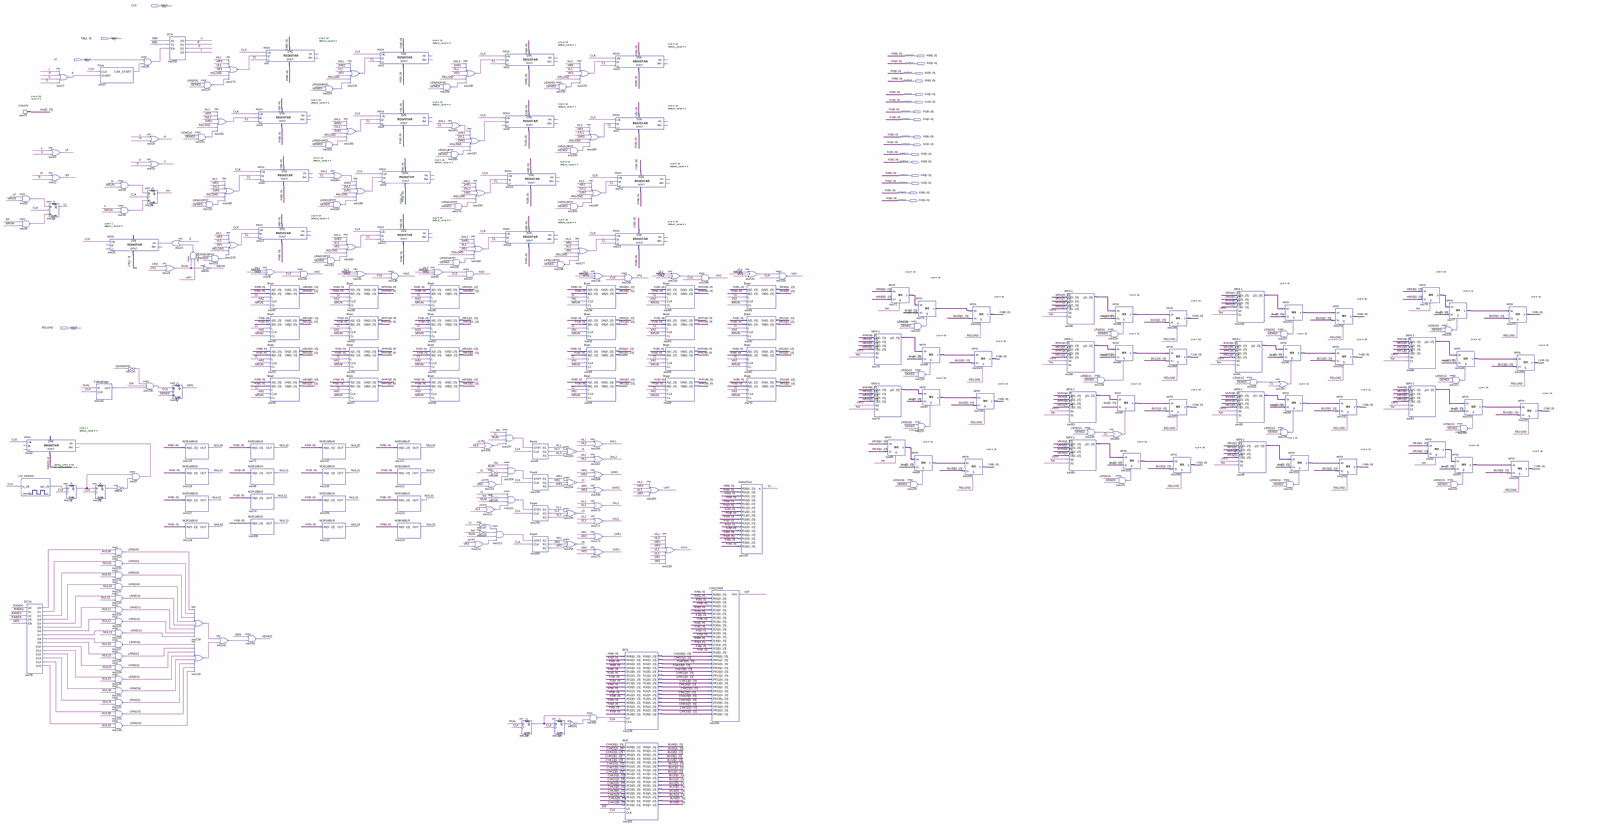
[diagram p0: schematic sheet, whole]
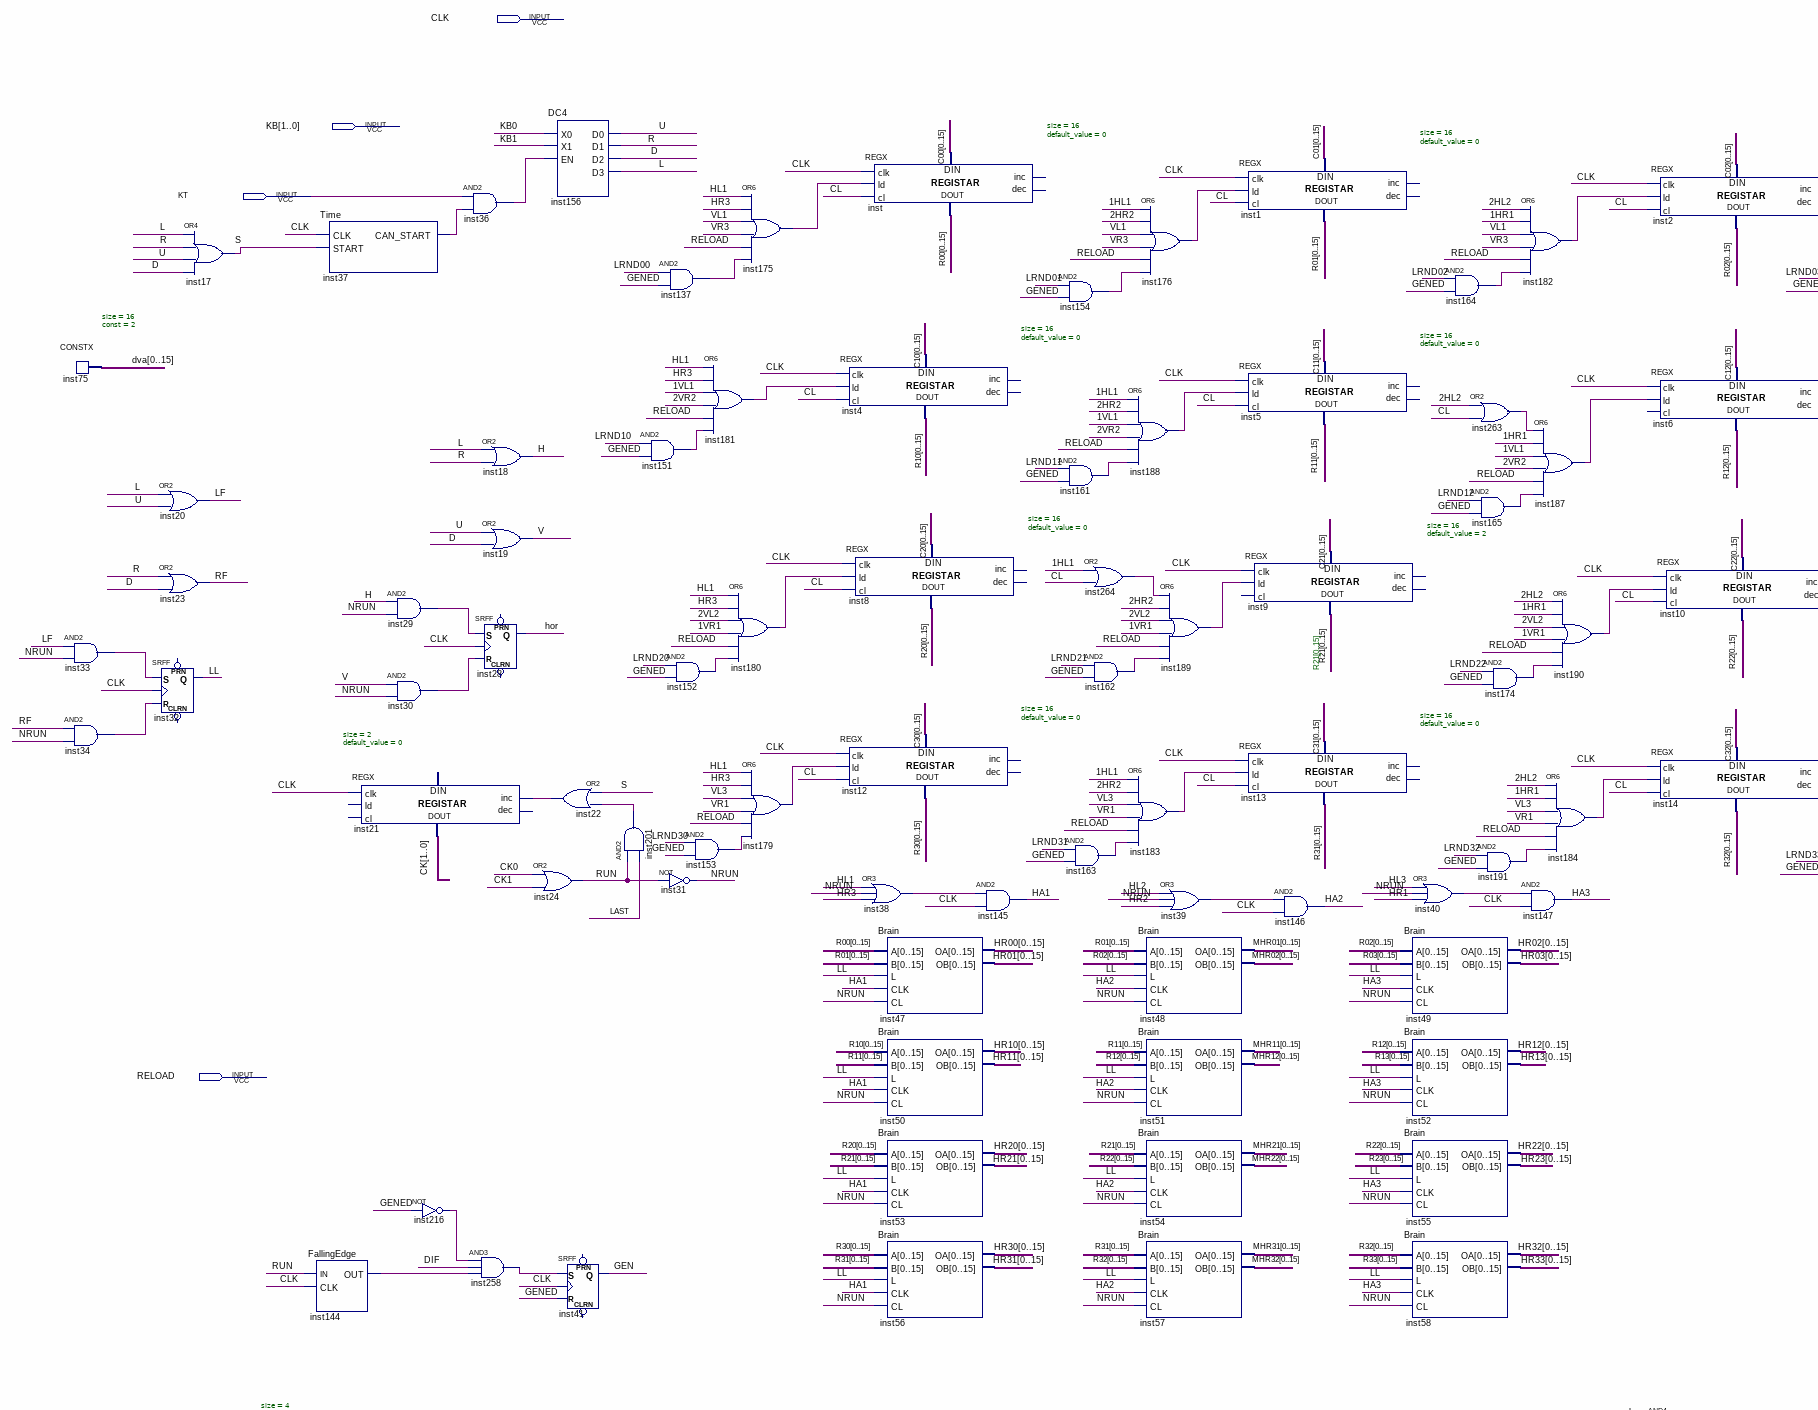
[diagram p1: schematic sheet, upper left part]
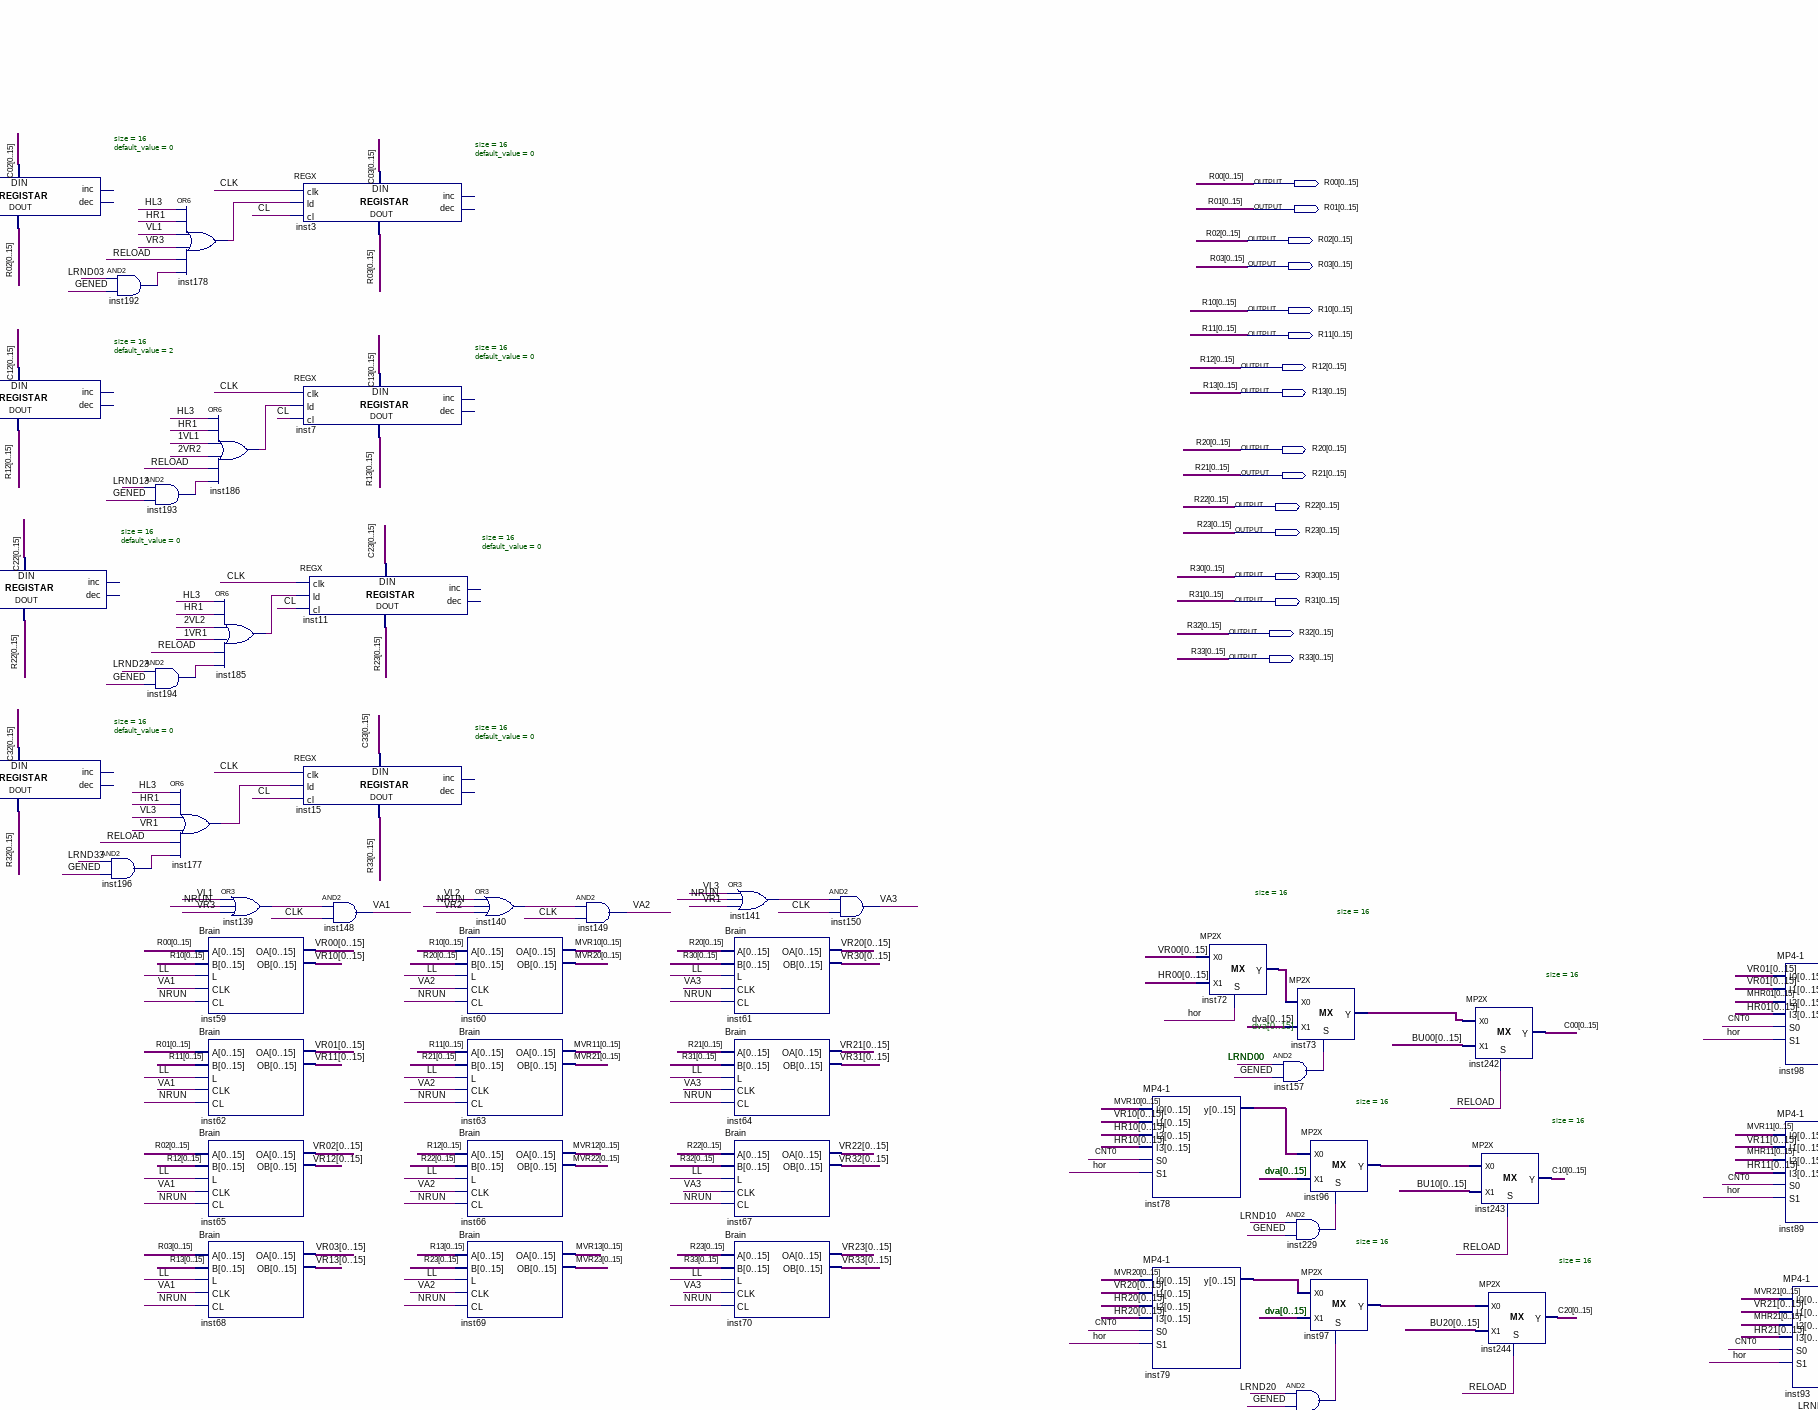
[diagram p2: schematic sheet, upper centre part]
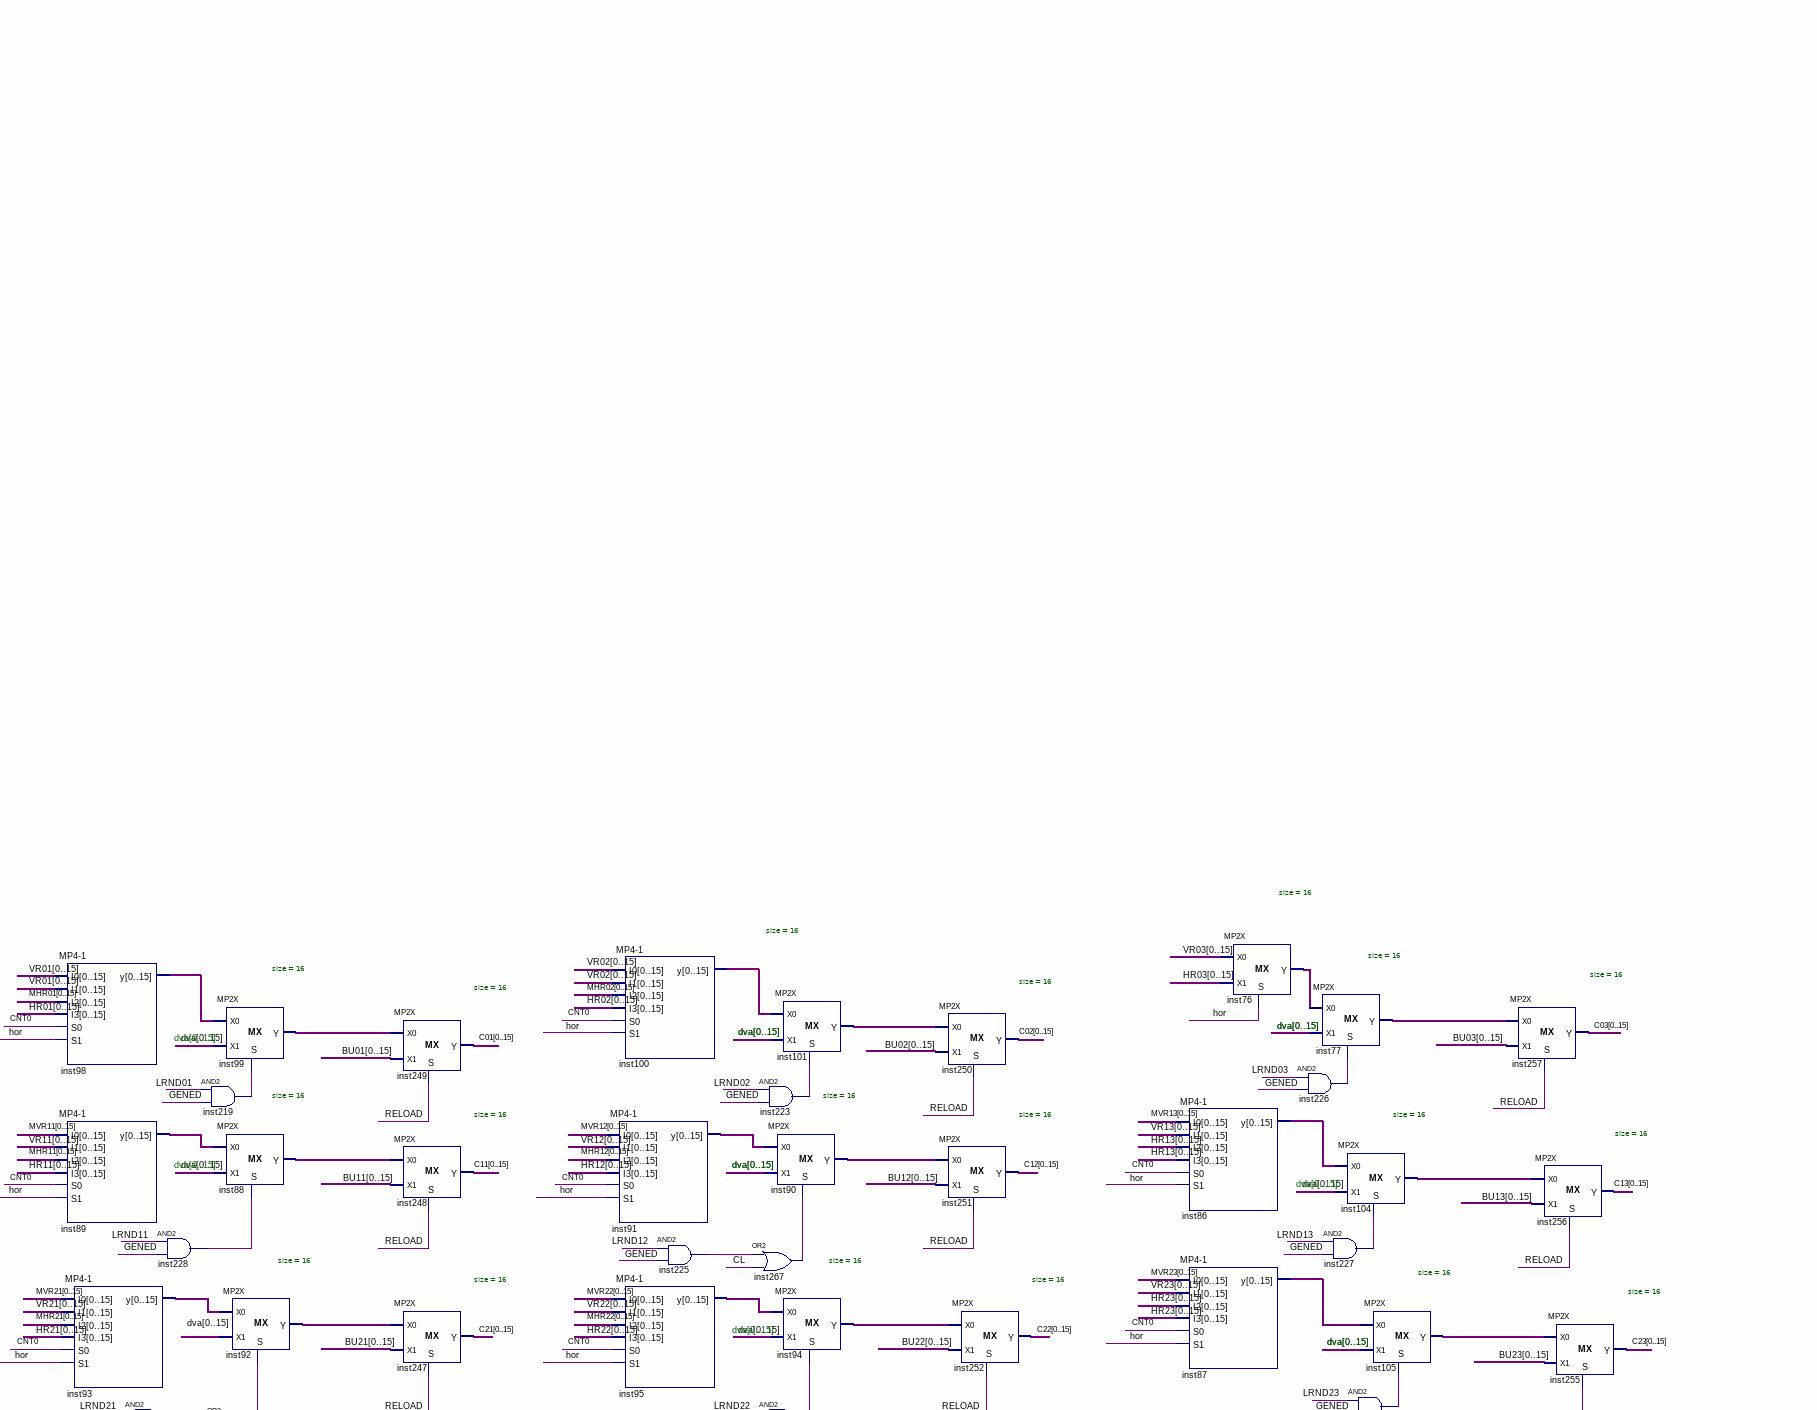
[diagram p3: schematic sheet, upper right part]
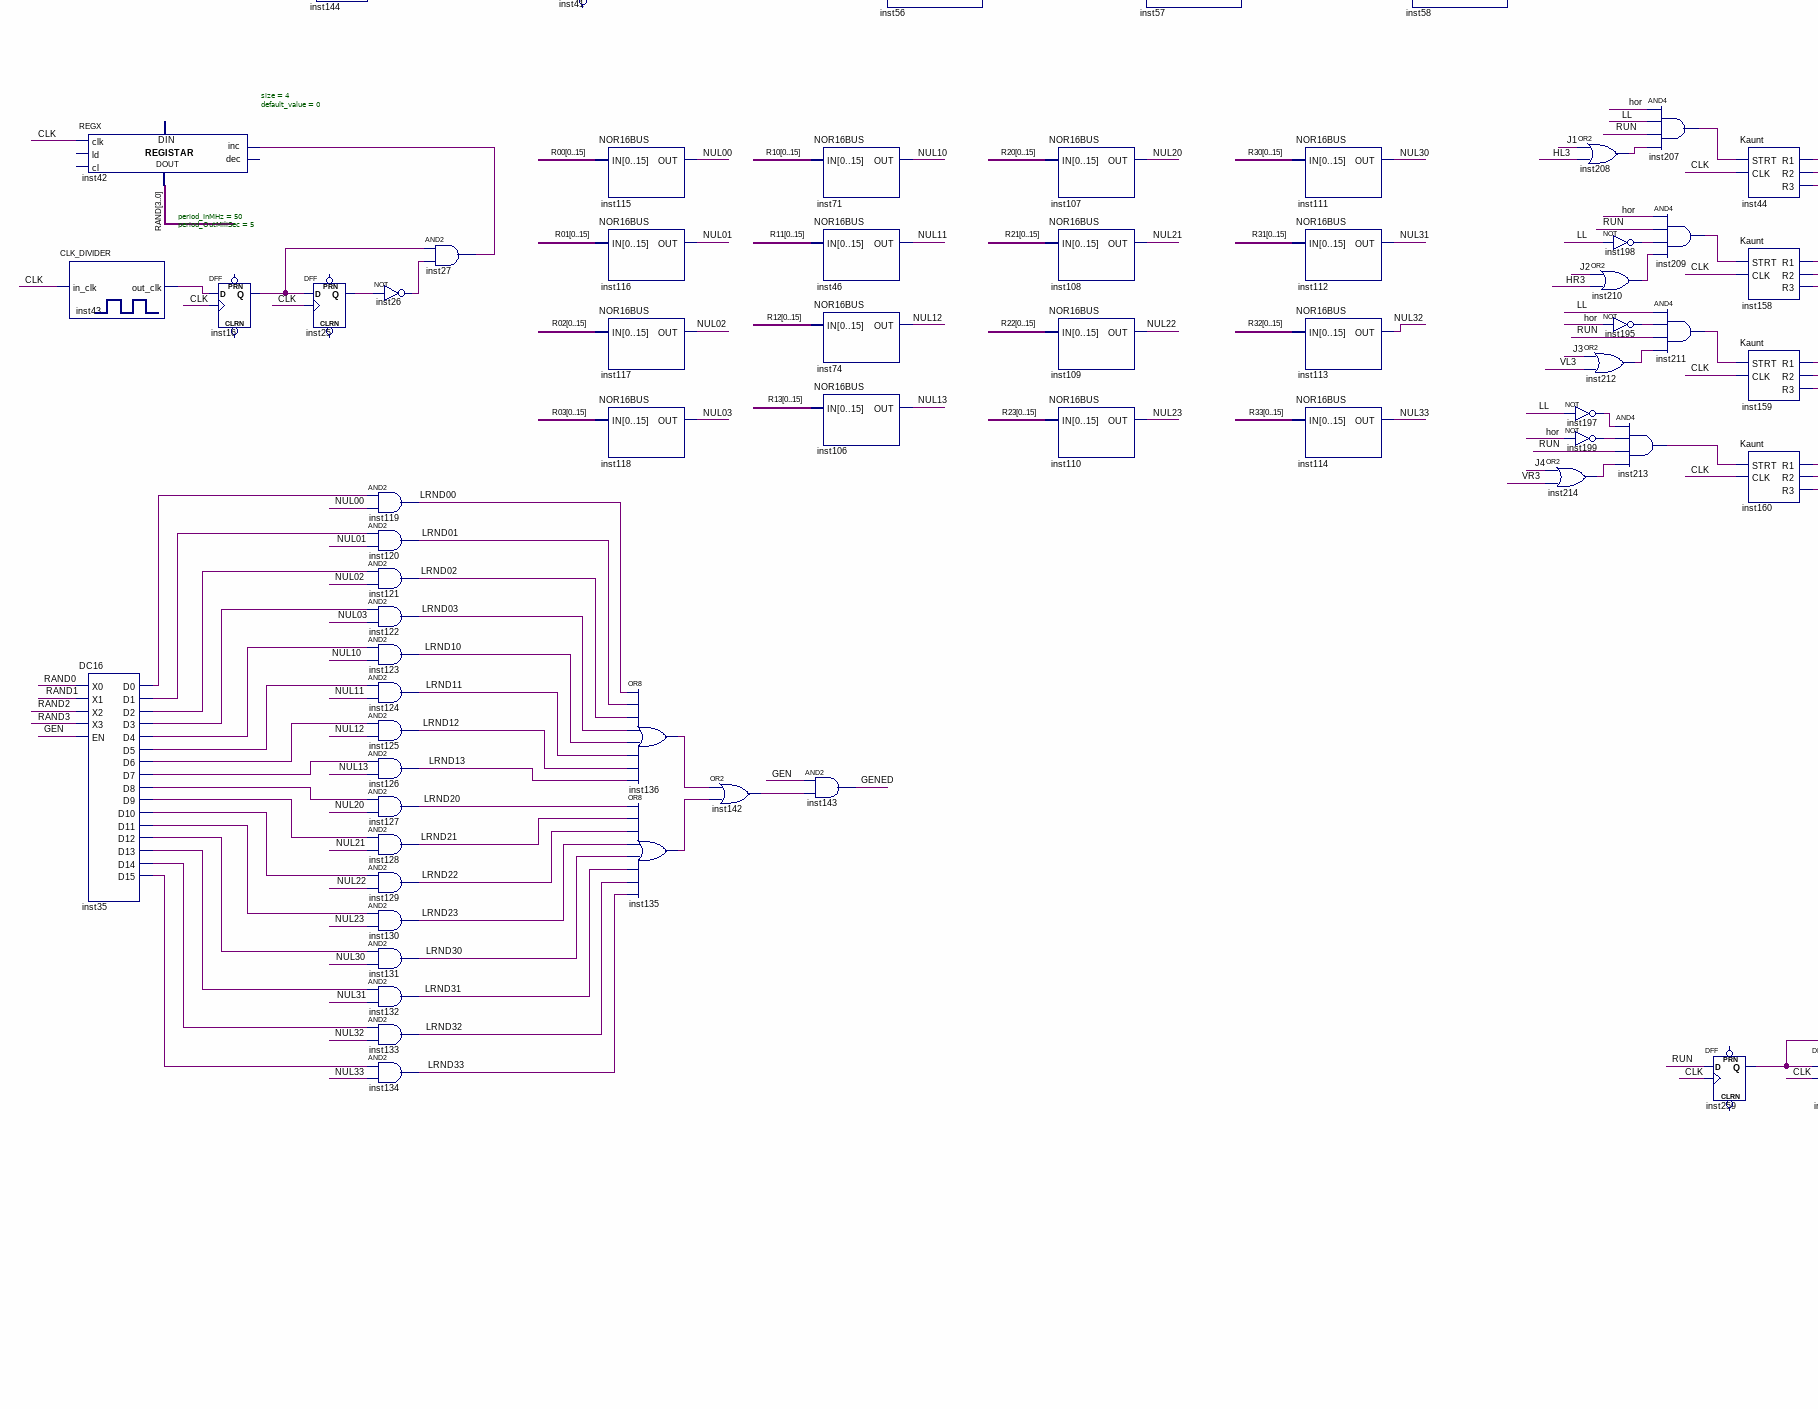
[diagram p4: schematic sheet, lower left part]
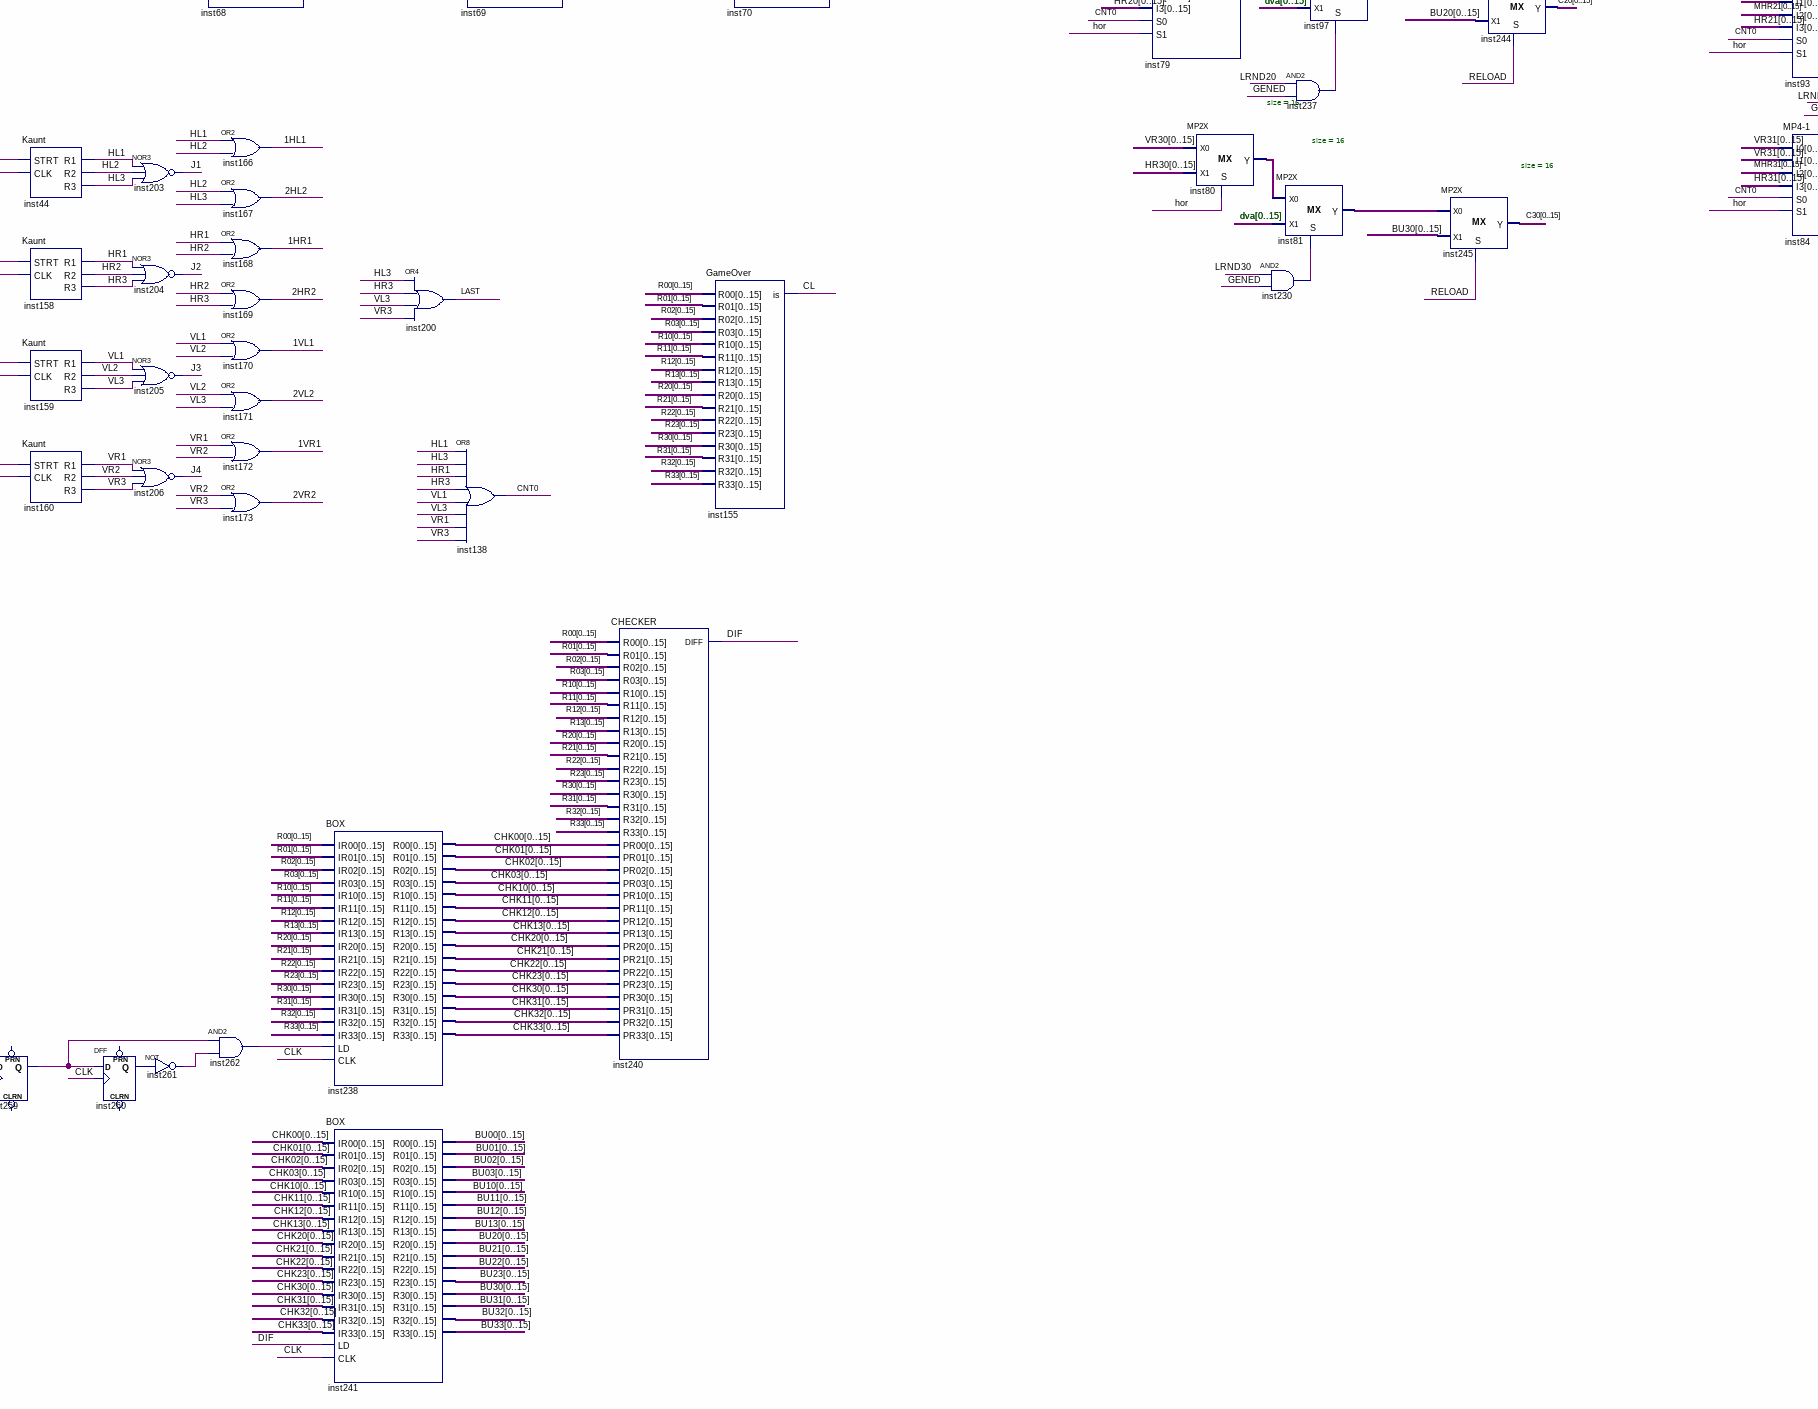
[diagram p5: schematic sheet, lower centre part]
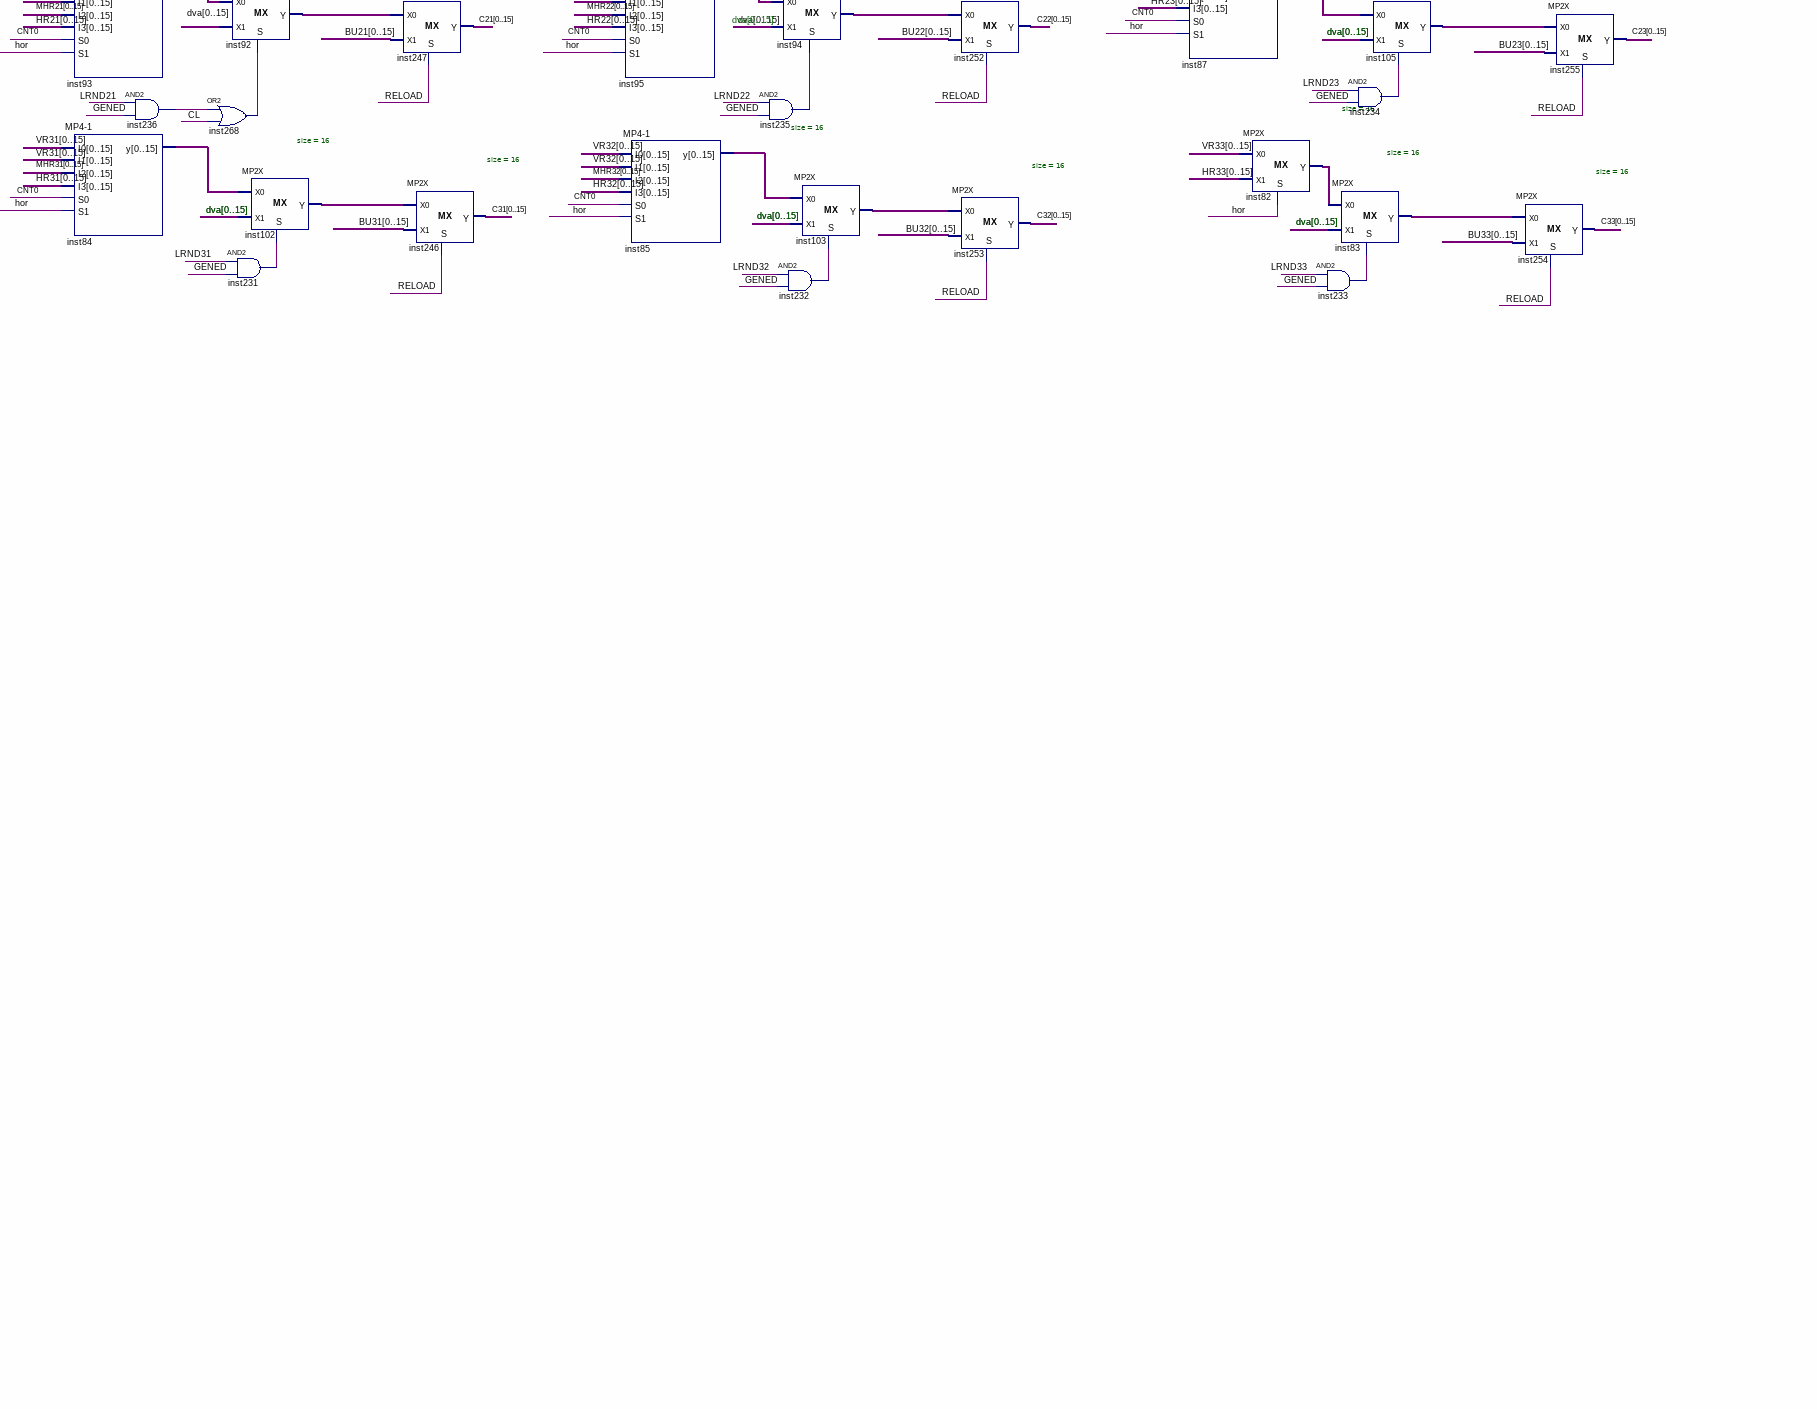
[diagram p6: schematic sheet, lower right part]
// Quartus schematic 2048.bdf as structural Verilog: 257 symbols, 20 pins
module \2048  (
  input  CLK,
  input  [1:0] KB,
  input  KT,
  input  RELOAD,
  output [0:15] R00,
  output [0:15] R01,
  output [0:15] R02,
  output [0:15] R03,
  output [0:15] R10,
  output [0:15] R11,
  output [0:15] R12,
  output [0:15] R13,
  output [0:15] R20,
  output [0:15] R21,
  output [0:15] R22,
  output [0:15] R23,
  output [0:15] R30,
  output [0:15] R31,
  output [0:15] R32,
  output [0:15] R33
);

  wire \1HL1 , \1HR1 , \1VL1 , \1VR1 , \2HL2 , \2HR2 , \2VL2 , \2VR2 , CL, CNT0, D, DIF, GEN, GENED, H, HA1,
       HA2, HA3, HL1, HL2, HL3, hor, HR1, HR2, HR3, inst16_q, inst22_out, inst25_q, inst26_out, inst27_out,
       inst29_out, inst30_out, inst33_out, inst34_out, inst35_d0, inst35_d1, inst35_d2, inst35_d3, inst35_d4,
       inst35_d5, inst35_d6, inst35_d7, inst35_d8, inst35_d9, inst35_d10, inst35_d11, inst35_d12, inst35_d13,
       inst35_d14, inst35_d15, inst36_out, inst37_can_start, inst38_out, inst39_out, inst40_out,
       inst43_out_clk, inst135_out, inst136_out, inst137_out, inst139_out, inst140_out, inst141_out,
       inst142_out, inst144_out, inst151_out, inst152_out, inst153_out, inst154_out, inst157_out,
       inst161_out, inst162_out, inst163_out, inst164_out, inst165_out, inst174_out, inst175_out,
       inst176_out, inst177_out, inst178_out, inst179_out, inst180_out, inst181_out, inst182_out,
       inst183_out, inst184_out, inst185_out, inst186_out, inst187_out, inst188_out, inst189_out,
       inst190_out, inst191_out, inst192_out, inst193_out, inst194_out, inst195_out, inst196_out,
       inst197_out, inst198_out, inst199_out, inst201_out, inst207_out, inst208_out, inst209_out,
       inst210_out, inst211_out, inst212_out, inst213_out, inst214_out, inst216_out, inst219_out,
       inst223_out, inst225_out, inst226_out, inst227_out, inst228_out, inst229_out, inst230_out,
       inst231_out, inst232_out, inst233_out, inst234_out, inst235_out, inst236_out, inst237_out,
       inst258_out, inst259_q, inst260_q, inst261_out, inst262_out, inst263_out, inst264_out, inst267_out,
       inst268_out, J1, J2, J3, J4, L, LAST, LF, LL, LRND00, LRND01, LRND02, LRND03, LRND10, LRND11, LRND12,
       LRND13, LRND20, LRND21, LRND22, LRND23, LRND30, LRND31, LRND32, LRND33, NRUN, NUL00, NUL01, NUL02,
       NUL03, NUL10, NUL11, NUL12, NUL13, NUL20, NUL21, NUL22, NUL23, NUL30, NUL31, NUL32, NUL33, R, RF, RUN,
       S, U, V, VA1, VA2, VA3, VL1, VL2, VL3, VR1, VR2, VR3;
  wire [1:0] CK;
  wire [3:0] RAND;
  wire [15:0] BU00, BU01, BU02, BU03, BU10, BU11, BU12, BU13, BU20, BU21, BU22, BU23, BU30, BU31, BU32, BU33,
       C00, C01, C02, C03, C10, C11, C12, C13, C20, C21, C22, C23, C30, C31, C32, C33, CHK00, CHK01, CHK02,
       CHK03, CHK10, CHK11, CHK12, CHK13, CHK20, CHK21, CHK22, CHK23, CHK30, CHK31, CHK32, CHK33, dva, HR00,
       HR01, HR02, HR03, HR10, HR11, HR12, HR13, HR20, HR21, HR22, HR23, HR30, HR31, HR32, HR33, inst72_y,
       inst73_y, inst76_y, inst77_y, inst78_y, inst79_y, inst80_y, inst81_y, inst82_y, inst83_y, inst84_y,
       inst85_y, inst86_y, inst87_y, inst88_y, inst89_y, inst90_y, inst91_y, inst92_y, inst93_y, inst94_y,
       inst95_y, inst96_y, inst97_y, inst98_y, inst99_y, inst100_y, inst101_y, inst102_y, inst103_y,
       inst104_y, inst105_y, MHR01, MHR02, MHR11, MHR12, MHR21, MHR22, MHR31, MHR32, MVR10, MVR11, MVR12,
       MVR13, MVR20, MVR21, MVR22, MVR23, VR00, VR01, VR02, VR03, VR10, VR11, VR12, VR13, VR20, VR21, VR22,
       VR23, VR30, VR31, VR32, VR33;

  CONSTX #(.size(16), .\const (2)) inst75 (.data({dva[0], dva[1], dva[2], dva[3], dva[4], dva[5], dva[6], dva[7], dva[8], dva[9], dva[10], dva[11], dva[12], dva[13], dva[14], dva[15]}));
  and inst33 (inst33_out, LF, NRUN);
  and inst34 (inst34_out, RF, NRUN);
  REGX #(.size(4), .default_value(0)) inst42 (
    .clk(CLK), .inc(inst27_out), .data_out(RAND));  // open: ld, cl, dec, data_in
  CLK_DIVIDER #(.period_InMHz(50), .period_OutMiliSec(5)) inst43 (.in_clk(CLK), .out_clk(inst43_out_clk));
  DC16 inst35 (
    .X0(RAND[0]), .X1(RAND[1]), .X2(RAND[2]), .X3(RAND[3]), .EN(GEN), .D0(inst35_d0), .D1(inst35_d1),
    .D2(inst35_d2), .D3(inst35_d3), .D4(inst35_d4), .D5(inst35_d5), .D6(inst35_d6), .D7(inst35_d7),
    .D8(inst35_d8), .D9(inst35_d9), .D10(inst35_d10), .D11(inst35_d11), .D12(inst35_d12), .D13(inst35_d13),
    .D14(inst35_d14), .D15(inst35_d15));
  or inst17 (S, L, R, U, D);
  or inst20 (LF, L, U);
  or inst23 (RF, R, D);
  SRFF inst32 (.S(inst33_out), .R(inst34_out), .CLK(CLK), .Q(LL));  // open: PRN, CLRN
  DFF inst16 (.CLK(CLK), .D(inst43_out_clk), .Q(inst16_q));  // open: CLRN, PRN
  Time inst37 (.CLK(CLK), .START(S), .CAN_START(inst37_can_start));
  FallingEdge inst144 (.IN(RUN), .CLK(CLK), .OUT(inst144_out));
  DFF inst25 (.CLK(CLK), .D(inst16_q), .Q(inst25_q));  // open: CLRN, PRN
  and inst29 (inst29_out, H, NRUN);
  and inst30 (inst30_out, V, NRUN);
  REGX #(.size(2), .default_value(0)) inst21 (
    .clk(CLK), .inc(inst22_out), .data_out(CK));  // open: ld, cl, dec, data_in
  not inst26 (inst26_out, inst25_q);
  and inst119 (LRND00, inst35_d0, NUL00);
  and inst120 (LRND01, inst35_d1, NUL01);
  and inst121 (LRND02, inst35_d2, NUL02);
  and inst122 (LRND03, inst35_d3, NUL03);
  and inst123 (LRND10, inst35_d4, NUL10);
  and inst124 (LRND11, inst35_d5, NUL11);
  and inst125 (LRND12, inst35_d6, NUL12);
  and inst126 (LRND13, inst35_d7, NUL13);
  and inst127 (LRND20, inst35_d8, NUL20);
  and inst128 (LRND21, inst35_d9, NUL21);
  and inst129 (LRND22, inst35_d10, NUL22);
  and inst130 (LRND23, inst35_d11, NUL23);
  and inst131 (LRND30, inst35_d12, NUL30);
  and inst132 (LRND31, inst35_d13, NUL31);
  and inst133 (LRND32, inst35_d14, NUL32);
  and inst134 (LRND33, inst35_d15, NUL33);
  not inst216 (inst216_out, GENED);
  and inst27 (inst27_out, inst16_q, inst26_out);
  and inst36 (inst36_out, KT, inst37_can_start);
  or inst18 (H, L, R);
  or inst19 (V, U, D);
  SRFF inst28 (.S(inst29_out), .R(inst30_out), .CLK(CLK), .Q(hor));  // open: PRN, CLRN
  and inst258 (inst258_out, inst216_out, DIF, inst144_out);
  DC4 inst156 (.X0(KB[0]), .X1(KB[1]), .EN(inst36_out), .D0(U), .D1(R), .D2(D), .D3(L));
  or inst24 (RUN, CK[0], CK[1]);
  or inst22 (inst22_out, S, inst201_out);
  SRFF inst41 (.S(inst258_out), .R(GENED), .CLK(CLK), .Q(GEN));  // open: PRN, CLRN
  NOR16BUS inst115 (.IN(R00), .OUT(NUL00));
  NOR16BUS inst116 (.IN(R01), .OUT(NUL01));
  NOR16BUS inst117 (.IN(R02), .OUT(NUL02));
  NOR16BUS inst118 (.IN(R03), .OUT(NUL03));
  and inst151 (inst151_out, LRND10, GENED);
  and inst201 (inst201_out, RUN, LAST);
  or inst136 (inst136_out, LRND00, LRND01, LRND02, LRND03, LRND10, LRND11, LRND12, LRND13);
  or inst135 (inst135_out, LRND20, LRND21, LRND22, LRND23, LRND30, LRND31, LRND32, LRND33);
  and inst137 (inst137_out, LRND00, GENED);
  and inst152 (inst152_out, LRND20, GENED);
  and inst153 (inst153_out, LRND30, GENED);
  not inst31 (NRUN, RUN);
  or inst175 (inst175_out, HL1, HR3, VL1, VR3, RELOAD, inst137_out);
  or inst181 (inst181_out, HL1, HR3, \1VL1 , \2VR2 , RELOAD, inst151_out);
  or inst180 (inst180_out, HL1, HR3, \2VL2 , \1VR1 , RELOAD, inst152_out);
  or inst179 (inst179_out, HL1, HR3, VL3, VR1, RELOAD, inst153_out);
  or inst142 (inst142_out, inst136_out, inst135_out);
  REGX #(.size(16), .default_value(0)) inst4 (
    .clk(CLK), .ld(inst181_out), .cl(CL),
    .data_in({C10[0], C10[1], C10[2], C10[3], C10[4], C10[5], C10[6], C10[7], C10[8], C10[9], C10[10], C10[11], C10[12], C10[13], C10[14], C10[15]}),
    .data_out(R10));  // open: inc, dec
  REGX #(.size(16), .default_value(0)) inst8 (
    .clk(CLK), .ld(inst180_out), .cl(CL),
    .data_in({C20[0], C20[1], C20[2], C20[3], C20[4], C20[5], C20[6], C20[7], C20[8], C20[9], C20[10], C20[11], C20[12], C20[13], C20[14], C20[15]}),
    .data_out(R20));  // open: inc, dec
  REGX #(.size(16), .default_value(0)) inst12 (
    .clk(CLK), .ld(inst179_out), .cl(CL),
    .data_in({C30[0], C30[1], C30[2], C30[3], C30[4], C30[5], C30[6], C30[7], C30[8], C30[9], C30[10], C30[11], C30[12], C30[13], C30[14], C30[15]}),
    .data_out(R30));  // open: inc, dec
  NOR16BUS inst71 (.IN(R10), .OUT(NUL10));
  NOR16BUS inst46 (.IN(R11), .OUT(NUL11));
  NOR16BUS inst74 (.IN(R12), .OUT(NUL12));
  NOR16BUS inst106 (.IN(R13), .OUT(NUL13));
  and inst143 (GENED, GEN, inst142_out);
  REGX #(.size(16), .default_value(0)) inst (
    .clk(CLK), .ld(inst175_out), .cl(CL),
    .data_in({C00[0], C00[1], C00[2], C00[3], C00[4], C00[5], C00[6], C00[7], C00[8], C00[9], C00[10], C00[11], C00[12], C00[13], C00[14], C00[15]}),
    .data_out(R00));  // open: inc, dec
  or inst38 (inst38_out, HL1, NRUN, HR3);
  Brain inst47 (
    .A(R00), .B(R01), .L(LL), .CLK(HA1), .CL(NRUN),
    .OA({HR00[0], HR00[1], HR00[2], HR00[3], HR00[4], HR00[5], HR00[6], HR00[7], HR00[8], HR00[9], HR00[10], HR00[11], HR00[12], HR00[13], HR00[14], HR00[15]}),
    .OB({HR01[0], HR01[1], HR01[2], HR01[3], HR01[4], HR01[5], HR01[6], HR01[7], HR01[8], HR01[9], HR01[10], HR01[11], HR01[12], HR01[13], HR01[14], HR01[15]}));
  Brain inst50 (
    .A(R10), .B(R11), .L(LL), .CLK(HA1), .CL(NRUN),
    .OA({HR10[0], HR10[1], HR10[2], HR10[3], HR10[4], HR10[5], HR10[6], HR10[7], HR10[8], HR10[9], HR10[10], HR10[11], HR10[12], HR10[13], HR10[14], HR10[15]}),
    .OB({HR11[0], HR11[1], HR11[2], HR11[3], HR11[4], HR11[5], HR11[6], HR11[7], HR11[8], HR11[9], HR11[10], HR11[11], HR11[12], HR11[13], HR11[14], HR11[15]}));
  Brain inst53 (
    .A(R20), .B(R21), .L(LL), .CLK(HA1), .CL(NRUN),
    .OA({HR20[0], HR20[1], HR20[2], HR20[3], HR20[4], HR20[5], HR20[6], HR20[7], HR20[8], HR20[9], HR20[10], HR20[11], HR20[12], HR20[13], HR20[14], HR20[15]}),
    .OB({HR21[0], HR21[1], HR21[2], HR21[3], HR21[4], HR21[5], HR21[6], HR21[7], HR21[8], HR21[9], HR21[10], HR21[11], HR21[12], HR21[13], HR21[14], HR21[15]}));
  Brain inst56 (
    .A(R30), .B(R31), .L(LL), .CLK(HA1), .CL(NRUN),
    .OA({HR30[0], HR30[1], HR30[2], HR30[3], HR30[4], HR30[5], HR30[6], HR30[7], HR30[8], HR30[9], HR30[10], HR30[11], HR30[12], HR30[13], HR30[14], HR30[15]}),
    .OB({HR31[0], HR31[1], HR31[2], HR31[3], HR31[4], HR31[5], HR31[6], HR31[7], HR31[8], HR31[9], HR31[10], HR31[11], HR31[12], HR31[13], HR31[14], HR31[15]}));
  and inst145 (HA1, inst38_out, CLK);
  NOR16BUS inst107 (.IN(R20), .OUT(NUL20));
  NOR16BUS inst108 (.IN(R21), .OUT(NUL21));
  NOR16BUS inst109 (.IN(R22), .OUT(NUL22));
  NOR16BUS inst110 (.IN(R23), .OUT(NUL23));
  and inst154 (inst154_out, LRND01, GENED);
  and inst161 (inst161_out, LRND11, GENED);
  or inst264 (inst264_out, \1HL1 , CL);
  and inst162 (inst162_out, LRND21, GENED);
  and inst163 (inst163_out, LRND31, GENED);
  or inst176 (inst176_out, \1HL1 , \2HR2 , VL1, VR3, RELOAD, inst154_out);
  or inst188 (inst188_out, \1HL1 , \2HR2 , \1VL1 , \2VR2 , RELOAD, inst161_out);
  or inst183 (inst183_out, \1HL1 , \2HR2 , VL3, VR1, RELOAD, inst163_out);
  Brain inst48 (
    .A(R01), .B(R02), .L(LL), .CLK(HA2), .CL(NRUN),
    .OA({MHR01[0], MHR01[1], MHR01[2], MHR01[3], MHR01[4], MHR01[5], MHR01[6], MHR01[7], MHR01[8], MHR01[9], MHR01[10], MHR01[11], MHR01[12], MHR01[13], MHR01[14], MHR01[15]}),
    .OB({MHR02[0], MHR02[1], MHR02[2], MHR02[3], MHR02[4], MHR02[5], MHR02[6], MHR02[7], MHR02[8], MHR02[9], MHR02[10], MHR02[11], MHR02[12], MHR02[13], MHR02[14], MHR02[15]}));
  Brain inst51 (
    .A(R11), .B(R12), .L(LL), .CLK(HA2), .CL(NRUN),
    .OA({MHR11[0], MHR11[1], MHR11[2], MHR11[3], MHR11[4], MHR11[5], MHR11[6], MHR11[7], MHR11[8], MHR11[9], MHR11[10], MHR11[11], MHR11[12], MHR11[13], MHR11[14], MHR11[15]}),
    .OB({MHR12[0], MHR12[1], MHR12[2], MHR12[3], MHR12[4], MHR12[5], MHR12[6], MHR12[7], MHR12[8], MHR12[9], MHR12[10], MHR12[11], MHR12[12], MHR12[13], MHR12[14], MHR12[15]}));
  Brain inst54 (
    .A(R21), .B(R22), .L(LL), .CLK(HA2), .CL(NRUN),
    .OA({MHR21[0], MHR21[1], MHR21[2], MHR21[3], MHR21[4], MHR21[5], MHR21[6], MHR21[7], MHR21[8], MHR21[9], MHR21[10], MHR21[11], MHR21[12], MHR21[13], MHR21[14], MHR21[15]}),
    .OB({MHR22[0], MHR22[1], MHR22[2], MHR22[3], MHR22[4], MHR22[5], MHR22[6], MHR22[7], MHR22[8], MHR22[9], MHR22[10], MHR22[11], MHR22[12], MHR22[13], MHR22[14], MHR22[15]}));
  Brain inst57 (
    .A(R31), .B(R32), .L(LL), .CLK(HA2), .CL(NRUN),
    .OA({MHR31[0], MHR31[1], MHR31[2], MHR31[3], MHR31[4], MHR31[5], MHR31[6], MHR31[7], MHR31[8], MHR31[9], MHR31[10], MHR31[11], MHR31[12], MHR31[13], MHR31[14], MHR31[15]}),
    .OB({MHR32[0], MHR32[1], MHR32[2], MHR32[3], MHR32[4], MHR32[5], MHR32[6], MHR32[7], MHR32[8], MHR32[9], MHR32[10], MHR32[11], MHR32[12], MHR32[13], MHR32[14], MHR32[15]}));
  or inst189 (inst189_out, inst264_out, \2HR2 , \2VL2 , \1VR1 , RELOAD, inst162_out);
  or inst39 (inst39_out, HL2, NRUN, HR2);
  REGX #(.size(16), .default_value(0)) inst1 (
    .clk(CLK), .ld(inst176_out), .cl(CL),
    .data_in({C01[0], C01[1], C01[2], C01[3], C01[4], C01[5], C01[6], C01[7], C01[8], C01[9], C01[10], C01[11], C01[12], C01[13], C01[14], C01[15]}),
    .data_out(R01));  // open: inc, dec
  REGX #(.size(16), .default_value(0)) inst5 (
    .clk(CLK), .ld(inst188_out), .cl(CL),
    .data_in({C11[0], C11[1], C11[2], C11[3], C11[4], C11[5], C11[6], C11[7], C11[8], C11[9], C11[10], C11[11], C11[12], C11[13], C11[14], C11[15]}),
    .data_out(R11));  // open: inc, dec
  REGX #(.size(16), .default_value(2)) inst9 (
    .clk(CLK), .ld(inst189_out),
    .data_in({C21[0], C21[1], C21[2], C21[3], C21[4], C21[5], C21[6], C21[7], C21[8], C21[9], C21[10], C21[11], C21[12], C21[13], C21[14], C21[15]}),
    .data_out(R21));  // open: cl, inc, dec
  REGX #(.size(16), .default_value(0)) inst13 (
    .clk(CLK), .ld(inst183_out), .cl(CL),
    .data_in({C31[0], C31[1], C31[2], C31[3], C31[4], C31[5], C31[6], C31[7], C31[8], C31[9], C31[10], C31[11], C31[12], C31[13], C31[14], C31[15]}),
    .data_out(R31));  // open: inc, dec
  and inst146 (HA2, inst39_out, CLK);
  NOR16BUS inst111 (.IN(R30), .OUT(NUL30));
  NOR16BUS inst112 (.IN(R31), .OUT(NUL31));
  NOR16BUS inst113 (.IN(R32), .OUT(NUL32));
  NOR16BUS inst114 (.IN(R33), .OUT(NUL33));
  Brain inst49 (
    .A(R02), .B(R03), .L(LL), .CLK(HA3), .CL(NRUN),
    .OA({HR02[0], HR02[1], HR02[2], HR02[3], HR02[4], HR02[5], HR02[6], HR02[7], HR02[8], HR02[9], HR02[10], HR02[11], HR02[12], HR02[13], HR02[14], HR02[15]}),
    .OB({HR03[0], HR03[1], HR03[2], HR03[3], HR03[4], HR03[5], HR03[6], HR03[7], HR03[8], HR03[9], HR03[10], HR03[11], HR03[12], HR03[13], HR03[14], HR03[15]}));
  Brain inst52 (
    .A(R12), .B(R13), .L(LL), .CLK(HA3), .CL(NRUN),
    .OA({HR12[0], HR12[1], HR12[2], HR12[3], HR12[4], HR12[5], HR12[6], HR12[7], HR12[8], HR12[9], HR12[10], HR12[11], HR12[12], HR12[13], HR12[14], HR12[15]}),
    .OB({HR13[0], HR13[1], HR13[2], HR13[3], HR13[4], HR13[5], HR13[6], HR13[7], HR13[8], HR13[9], HR13[10], HR13[11], HR13[12], HR13[13], HR13[14], HR13[15]}));
  Brain inst55 (
    .A(R22), .B(R23), .L(LL), .CLK(HA3), .CL(NRUN),
    .OA({HR22[0], HR22[1], HR22[2], HR22[3], HR22[4], HR22[5], HR22[6], HR22[7], HR22[8], HR22[9], HR22[10], HR22[11], HR22[12], HR22[13], HR22[14], HR22[15]}),
    .OB({HR23[0], HR23[1], HR23[2], HR23[3], HR23[4], HR23[5], HR23[6], HR23[7], HR23[8], HR23[9], HR23[10], HR23[11], HR23[12], HR23[13], HR23[14], HR23[15]}));
  Brain inst58 (
    .A(R32), .B(R33), .L(LL), .CLK(HA3), .CL(NRUN),
    .OA({HR32[0], HR32[1], HR32[2], HR32[3], HR32[4], HR32[5], HR32[6], HR32[7], HR32[8], HR32[9], HR32[10], HR32[11], HR32[12], HR32[13], HR32[14], HR32[15]}),
    .OB({HR33[0], HR33[1], HR33[2], HR33[3], HR33[4], HR33[5], HR33[6], HR33[7], HR33[8], HR33[9], HR33[10], HR33[11], HR33[12], HR33[13], HR33[14], HR33[15]}));
  and inst164 (inst164_out, LRND02, GENED);
  or inst40 (inst40_out, HL3, NRUN, HR1);
  or inst263 (inst263_out, \2HL2 , CL);
  and inst165 (inst165_out, LRND12, GENED);
  and inst174 (inst174_out, LRND22, GENED);
  and inst191 (inst191_out, LRND32, GENED);
  or inst182 (inst182_out, \2HL2 , \1HR1 , VL1, VR3, RELOAD, inst164_out);
  or inst187 (inst187_out, inst263_out, \1HR1 , \1VL1 , \2VR2 , RELOAD, inst165_out);
  or inst190 (inst190_out, \2HL2 , \1HR1 , \2VL2 , \1VR1 , RELOAD, inst174_out);
  or inst184 (inst184_out, \2HL2 , \1HR1 , VL3, VR1, RELOAD, inst191_out);
  and inst147 (HA3, inst40_out, CLK);
  or inst214 (inst214_out, J4, VR3);
  or inst208 (inst208_out, J1, HL3);
  not inst198 (inst198_out, LL);
  or inst210 (inst210_out, J2, HR3);
  not inst195 (inst195_out, hor);
  or inst212 (inst212_out, J3, VL3);
  not inst197 (inst197_out, LL);
  not inst199 (inst199_out, hor);
  REGX #(.size(16), .default_value(0)) inst2 (
    .clk(CLK), .ld(inst182_out), .cl(CL),
    .data_in({C02[0], C02[1], C02[2], C02[3], C02[4], C02[5], C02[6], C02[7], C02[8], C02[9], C02[10], C02[11], C02[12], C02[13], C02[14], C02[15]}),
    .data_out(R02));  // open: inc, dec
  REGX #(.size(16), .default_value(2)) inst6 (
    .clk(CLK), .ld(inst187_out),
    .data_in({C12[0], C12[1], C12[2], C12[3], C12[4], C12[5], C12[6], C12[7], C12[8], C12[9], C12[10], C12[11], C12[12], C12[13], C12[14], C12[15]}),
    .data_out(R12));  // open: cl, inc, dec
  REGX #(.size(16), .default_value(0)) inst10 (
    .clk(CLK), .ld(inst190_out), .cl(CL),
    .data_in({C22[0], C22[1], C22[2], C22[3], C22[4], C22[5], C22[6], C22[7], C22[8], C22[9], C22[10], C22[11], C22[12], C22[13], C22[14], C22[15]}),
    .data_out(R22));  // open: inc, dec
  REGX #(.size(16), .default_value(0)) inst14 (
    .clk(CLK), .ld(inst184_out), .cl(CL),
    .data_in({C32[0], C32[1], C32[2], C32[3], C32[4], C32[5], C32[6], C32[7], C32[8], C32[9], C32[10], C32[11], C32[12], C32[13], C32[14], C32[15]}),
    .data_out(R32));  // open: inc, dec
  and inst207 (inst207_out, hor, LL, RUN, inst208_out);
  and inst209 (inst209_out, hor, RUN, inst198_out, inst210_out);
  and inst211 (inst211_out, LL, inst195_out, RUN, inst212_out);
  and inst213 (inst213_out, inst197_out, inst199_out, RUN, inst214_out);
  DFF inst259 (.CLK(CLK), .D(RUN), .Q(inst259_q));  // open: CLRN, PRN
  Kaunt inst44 (.STRT(inst207_out), .CLK(CLK), .R1(HL1), .R2(HL2), .R3(HL3));
  Kaunt inst158 (.STRT(inst209_out), .CLK(CLK), .R1(HR1), .R2(HR2), .R3(HR3));
  Kaunt inst159 (.STRT(inst211_out), .CLK(CLK), .R1(VL1), .R2(VL2), .R3(VL3));
  Kaunt inst160 (.STRT(inst213_out), .CLK(CLK), .R1(VR1), .R2(VR2), .R3(VR3));
  DFF inst260 (.CLK(CLK), .D(inst259_q), .Q(inst260_q));  // open: CLRN, PRN
  and inst192 (inst192_out, LRND03, GENED);
  and inst193 (inst193_out, LRND13, GENED);
  and inst194 (inst194_out, LRND23, GENED);
  and inst196 (inst196_out, LRND33, GENED);
  nor inst203 (J1, HL1, HL2, HL3);
  nor inst204 (J2, HR1, HR2, HR3);
  nor inst205 (J3, VL1, VL2, VL3);
  nor inst206 (J4, VR1, VR2, VR3);
  not inst261 (inst261_out, inst260_q);
  or inst178 (inst178_out, HL3, HR1, VL1, VR3, RELOAD, inst192_out);
  or inst177 (inst177_out, HL3, HR1, VL3, VR1, RELOAD, inst196_out);
  Brain inst59 (
    .A(R00), .B(R10), .L(LL), .CLK(VA1), .CL(NRUN),
    .OA({VR00[0], VR00[1], VR00[2], VR00[3], VR00[4], VR00[5], VR00[6], VR00[7], VR00[8], VR00[9], VR00[10], VR00[11], VR00[12], VR00[13], VR00[14], VR00[15]}),
    .OB({VR10[0], VR10[1], VR10[2], VR10[3], VR10[4], VR10[5], VR10[6], VR10[7], VR10[8], VR10[9], VR10[10], VR10[11], VR10[12], VR10[13], VR10[14], VR10[15]}));
  Brain inst62 (
    .A(R01), .B(R11), .L(LL), .CLK(VA1), .CL(NRUN),
    .OA({VR01[0], VR01[1], VR01[2], VR01[3], VR01[4], VR01[5], VR01[6], VR01[7], VR01[8], VR01[9], VR01[10], VR01[11], VR01[12], VR01[13], VR01[14], VR01[15]}),
    .OB({VR11[0], VR11[1], VR11[2], VR11[3], VR11[4], VR11[5], VR11[6], VR11[7], VR11[8], VR11[9], VR11[10], VR11[11], VR11[12], VR11[13], VR11[14], VR11[15]}));
  Brain inst65 (
    .A(R02), .B(R12), .L(LL), .CLK(VA1), .CL(NRUN),
    .OA({VR02[0], VR02[1], VR02[2], VR02[3], VR02[4], VR02[5], VR02[6], VR02[7], VR02[8], VR02[9], VR02[10], VR02[11], VR02[12], VR02[13], VR02[14], VR02[15]}),
    .OB({VR12[0], VR12[1], VR12[2], VR12[3], VR12[4], VR12[5], VR12[6], VR12[7], VR12[8], VR12[9], VR12[10], VR12[11], VR12[12], VR12[13], VR12[14], VR12[15]}));
  Brain inst68 (
    .A(R03), .B(R13), .L(LL), .CLK(VA1), .CL(NRUN),
    .OA({VR03[0], VR03[1], VR03[2], VR03[3], VR03[4], VR03[5], VR03[6], VR03[7], VR03[8], VR03[9], VR03[10], VR03[11], VR03[12], VR03[13], VR03[14], VR03[15]}),
    .OB({VR13[0], VR13[1], VR13[2], VR13[3], VR13[4], VR13[5], VR13[6], VR13[7], VR13[8], VR13[9], VR13[10], VR13[11], VR13[12], VR13[13], VR13[14], VR13[15]}));
  or inst186 (inst186_out, HL3, HR1, \1VL1 , \2VR2 , RELOAD, inst193_out);
  or inst185 (inst185_out, HL3, HR1, \2VL2 , \1VR1 , RELOAD, inst194_out);
  or inst139 (inst139_out, VL1, NRUN, VR3);
  or inst166 (\1HL1 , HL1, HL2);
  or inst167 (\2HL2 , HL2, HL3);
  or inst168 (\1HR1 , HR1, HR2);
  or inst169 (\2HR2 , HR2, HR3);
  or inst170 (\1VL1 , VL1, VL2);
  or inst171 (\2VL2 , VL2, VL3);
  or inst172 (\1VR1 , VR1, VR2);
  or inst173 (\2VR2 , VR2, VR3);
  and inst262 (inst262_out, inst259_q, inst261_out);
  REGX #(.size(16), .default_value(0)) inst3 (
    .clk(CLK), .ld(inst178_out), .cl(CL),
    .data_in({C03[0], C03[1], C03[2], C03[3], C03[4], C03[5], C03[6], C03[7], C03[8], C03[9], C03[10], C03[11], C03[12], C03[13], C03[14], C03[15]}),
    .data_out(R03));  // open: inc, dec
  REGX #(.size(16), .default_value(0)) inst7 (
    .clk(CLK), .ld(inst186_out), .cl(CL),
    .data_in({C13[0], C13[1], C13[2], C13[3], C13[4], C13[5], C13[6], C13[7], C13[8], C13[9], C13[10], C13[11], C13[12], C13[13], C13[14], C13[15]}),
    .data_out(R13));  // open: inc, dec
  REGX #(.size(16), .default_value(0)) inst11 (
    .clk(CLK), .ld(inst185_out), .cl(CL),
    .data_in({C23[0], C23[1], C23[2], C23[3], C23[4], C23[5], C23[6], C23[7], C23[8], C23[9], C23[10], C23[11], C23[12], C23[13], C23[14], C23[15]}),
    .data_out(R23));  // open: inc, dec
  REGX #(.size(16), .default_value(0)) inst15 (
    .clk(CLK), .ld(inst177_out), .cl(CL),
    .data_in({C33[0], C33[1], C33[2], C33[3], C33[4], C33[5], C33[6], C33[7], C33[8], C33[9], C33[10], C33[11], C33[12], C33[13], C33[14], C33[15]}),
    .data_out(R33));  // open: inc, dec
  and inst148 (VA1, inst139_out, CLK);
  BOX inst238 (
    .IR00(R00), .IR01(R01), .IR02(R02), .IR03(R03), .IR10(R10), .IR11(R11), .IR12(R12), .IR13(R13),
    .IR20(R20), .IR21(R21), .IR22(R22), .IR23(R23), .IR30(R30), .IR31(R31), .IR32(R32), .IR33(R33),
    .LD(inst262_out), .CLK(CLK),
    .R00({CHK00[0], CHK00[1], CHK00[2], CHK00[3], CHK00[4], CHK00[5], CHK00[6], CHK00[7], CHK00[8], CHK00[9], CHK00[10], CHK00[11], CHK00[12], CHK00[13], CHK00[14], CHK00[15]}),
    .R01({CHK01[0], CHK01[1], CHK01[2], CHK01[3], CHK01[4], CHK01[5], CHK01[6], CHK01[7], CHK01[8], CHK01[9], CHK01[10], CHK01[11], CHK01[12], CHK01[13], CHK01[14], CHK01[15]}),
    .R02({CHK02[0], CHK02[1], CHK02[2], CHK02[3], CHK02[4], CHK02[5], CHK02[6], CHK02[7], CHK02[8], CHK02[9], CHK02[10], CHK02[11], CHK02[12], CHK02[13], CHK02[14], CHK02[15]}),
    .R03({CHK03[0], CHK03[1], CHK03[2], CHK03[3], CHK03[4], CHK03[5], CHK03[6], CHK03[7], CHK03[8], CHK03[9], CHK03[10], CHK03[11], CHK03[12], CHK03[13], CHK03[14], CHK03[15]}),
    .R10({CHK10[0], CHK10[1], CHK10[2], CHK10[3], CHK10[4], CHK10[5], CHK10[6], CHK10[7], CHK10[8], CHK10[9], CHK10[10], CHK10[11], CHK10[12], CHK10[13], CHK10[14], CHK10[15]}),
    .R11({CHK11[0], CHK11[1], CHK11[2], CHK11[3], CHK11[4], CHK11[5], CHK11[6], CHK11[7], CHK11[8], CHK11[9], CHK11[10], CHK11[11], CHK11[12], CHK11[13], CHK11[14], CHK11[15]}),
    .R12({CHK12[0], CHK12[1], CHK12[2], CHK12[3], CHK12[4], CHK12[5], CHK12[6], CHK12[7], CHK12[8], CHK12[9], CHK12[10], CHK12[11], CHK12[12], CHK12[13], CHK12[14], CHK12[15]}),
    .R13({CHK13[0], CHK13[1], CHK13[2], CHK13[3], CHK13[4], CHK13[5], CHK13[6], CHK13[7], CHK13[8], CHK13[9], CHK13[10], CHK13[11], CHK13[12], CHK13[13], CHK13[14], CHK13[15]}),
    .R20({CHK20[0], CHK20[1], CHK20[2], CHK20[3], CHK20[4], CHK20[5], CHK20[6], CHK20[7], CHK20[8], CHK20[9], CHK20[10], CHK20[11], CHK20[12], CHK20[13], CHK20[14], CHK20[15]}),
    .R21({CHK21[0], CHK21[1], CHK21[2], CHK21[3], CHK21[4], CHK21[5], CHK21[6], CHK21[7], CHK21[8], CHK21[9], CHK21[10], CHK21[11], CHK21[12], CHK21[13], CHK21[14], CHK21[15]}),
    .R22({CHK22[0], CHK22[1], CHK22[2], CHK22[3], CHK22[4], CHK22[5], CHK22[6], CHK22[7], CHK22[8], CHK22[9], CHK22[10], CHK22[11], CHK22[12], CHK22[13], CHK22[14], CHK22[15]}),
    .R23({CHK23[0], CHK23[1], CHK23[2], CHK23[3], CHK23[4], CHK23[5], CHK23[6], CHK23[7], CHK23[8], CHK23[9], CHK23[10], CHK23[11], CHK23[12], CHK23[13], CHK23[14], CHK23[15]}),
    .R30({CHK30[0], CHK30[1], CHK30[2], CHK30[3], CHK30[4], CHK30[5], CHK30[6], CHK30[7], CHK30[8], CHK30[9], CHK30[10], CHK30[11], CHK30[12], CHK30[13], CHK30[14], CHK30[15]}),
    .R31({CHK31[0], CHK31[1], CHK31[2], CHK31[3], CHK31[4], CHK31[5], CHK31[6], CHK31[7], CHK31[8], CHK31[9], CHK31[10], CHK31[11], CHK31[12], CHK31[13], CHK31[14], CHK31[15]}),
    .R32({CHK32[0], CHK32[1], CHK32[2], CHK32[3], CHK32[4], CHK32[5], CHK32[6], CHK32[7], CHK32[8], CHK32[9], CHK32[10], CHK32[11], CHK32[12], CHK32[13], CHK32[14], CHK32[15]}),
    .R33({CHK33[0], CHK33[1], CHK33[2], CHK33[3], CHK33[4], CHK33[5], CHK33[6], CHK33[7], CHK33[8], CHK33[9], CHK33[10], CHK33[11], CHK33[12], CHK33[13], CHK33[14], CHK33[15]}));
  BOX inst241 (
    .IR00({CHK00[0], CHK00[1], CHK00[2], CHK00[3], CHK00[4], CHK00[5], CHK00[6], CHK00[7], CHK00[8], CHK00[9], CHK00[10], CHK00[11], CHK00[12], CHK00[13], CHK00[14], CHK00[15]}),
    .IR01({CHK01[0], CHK01[1], CHK01[2], CHK01[3], CHK01[4], CHK01[5], CHK01[6], CHK01[7], CHK01[8], CHK01[9], CHK01[10], CHK01[11], CHK01[12], CHK01[13], CHK01[14], CHK01[15]}),
    .IR02({CHK02[0], CHK02[1], CHK02[2], CHK02[3], CHK02[4], CHK02[5], CHK02[6], CHK02[7], CHK02[8], CHK02[9], CHK02[10], CHK02[11], CHK02[12], CHK02[13], CHK02[14], CHK02[15]}),
    .IR03({CHK03[0], CHK03[1], CHK03[2], CHK03[3], CHK03[4], CHK03[5], CHK03[6], CHK03[7], CHK03[8], CHK03[9], CHK03[10], CHK03[11], CHK03[12], CHK03[13], CHK03[14], CHK03[15]}),
    .IR10({CHK10[0], CHK10[1], CHK10[2], CHK10[3], CHK10[4], CHK10[5], CHK10[6], CHK10[7], CHK10[8], CHK10[9], CHK10[10], CHK10[11], CHK10[12], CHK10[13], CHK10[14], CHK10[15]}),
    .IR11({CHK11[0], CHK11[1], CHK11[2], CHK11[3], CHK11[4], CHK11[5], CHK11[6], CHK11[7], CHK11[8], CHK11[9], CHK11[10], CHK11[11], CHK11[12], CHK11[13], CHK11[14], CHK11[15]}),
    .IR12({CHK12[0], CHK12[1], CHK12[2], CHK12[3], CHK12[4], CHK12[5], CHK12[6], CHK12[7], CHK12[8], CHK12[9], CHK12[10], CHK12[11], CHK12[12], CHK12[13], CHK12[14], CHK12[15]}),
    .IR13({CHK13[0], CHK13[1], CHK13[2], CHK13[3], CHK13[4], CHK13[5], CHK13[6], CHK13[7], CHK13[8], CHK13[9], CHK13[10], CHK13[11], CHK13[12], CHK13[13], CHK13[14], CHK13[15]}),
    .IR20({CHK20[0], CHK20[1], CHK20[2], CHK20[3], CHK20[4], CHK20[5], CHK20[6], CHK20[7], CHK20[8], CHK20[9], CHK20[10], CHK20[11], CHK20[12], CHK20[13], CHK20[14], CHK20[15]}),
    .IR21({CHK21[0], CHK21[1], CHK21[2], CHK21[3], CHK21[4], CHK21[5], CHK21[6], CHK21[7], CHK21[8], CHK21[9], CHK21[10], CHK21[11], CHK21[12], CHK21[13], CHK21[14], CHK21[15]}),
    .IR22({CHK22[0], CHK22[1], CHK22[2], CHK22[3], CHK22[4], CHK22[5], CHK22[6], CHK22[7], CHK22[8], CHK22[9], CHK22[10], CHK22[11], CHK22[12], CHK22[13], CHK22[14], CHK22[15]}),
    .IR23({CHK23[0], CHK23[1], CHK23[2], CHK23[3], CHK23[4], CHK23[5], CHK23[6], CHK23[7], CHK23[8], CHK23[9], CHK23[10], CHK23[11], CHK23[12], CHK23[13], CHK23[14], CHK23[15]}),
    .IR30({CHK30[0], CHK30[1], CHK30[2], CHK30[3], CHK30[4], CHK30[5], CHK30[6], CHK30[7], CHK30[8], CHK30[9], CHK30[10], CHK30[11], CHK30[12], CHK30[13], CHK30[14], CHK30[15]}),
    .IR31({CHK31[0], CHK31[1], CHK31[2], CHK31[3], CHK31[4], CHK31[5], CHK31[6], CHK31[7], CHK31[8], CHK31[9], CHK31[10], CHK31[11], CHK31[12], CHK31[13], CHK31[14], CHK31[15]}),
    .IR32({CHK32[0], CHK32[1], CHK32[2], CHK32[3], CHK32[4], CHK32[5], CHK32[6], CHK32[7], CHK32[8], CHK32[9], CHK32[10], CHK32[11], CHK32[12], CHK32[13], CHK32[14], CHK32[15]}),
    .IR33({CHK33[0], CHK33[1], CHK33[2], CHK33[3], CHK33[4], CHK33[5], CHK33[6], CHK33[7], CHK33[8], CHK33[9], CHK33[10], CHK33[11], CHK33[12], CHK33[13], CHK33[14], CHK33[15]}),
    .LD(DIF), .CLK(CLK),
    .R00({BU00[0], BU00[1], BU00[2], BU00[3], BU00[4], BU00[5], BU00[6], BU00[7], BU00[8], BU00[9], BU00[10], BU00[11], BU00[12], BU00[13], BU00[14], BU00[15]}),
    .R01({BU01[0], BU01[1], BU01[2], BU01[3], BU01[4], BU01[5], BU01[6], BU01[7], BU01[8], BU01[9], BU01[10], BU01[11], BU01[12], BU01[13], BU01[14], BU01[15]}),
    .R02({BU02[0], BU02[1], BU02[2], BU02[3], BU02[4], BU02[5], BU02[6], BU02[7], BU02[8], BU02[9], BU02[10], BU02[11], BU02[12], BU02[13], BU02[14], BU02[15]}),
    .R03({BU03[0], BU03[1], BU03[2], BU03[3], BU03[4], BU03[5], BU03[6], BU03[7], BU03[8], BU03[9], BU03[10], BU03[11], BU03[12], BU03[13], BU03[14], BU03[15]}),
    .R10({BU10[0], BU10[1], BU10[2], BU10[3], BU10[4], BU10[5], BU10[6], BU10[7], BU10[8], BU10[9], BU10[10], BU10[11], BU10[12], BU10[13], BU10[14], BU10[15]}),
    .R11({BU11[0], BU11[1], BU11[2], BU11[3], BU11[4], BU11[5], BU11[6], BU11[7], BU11[8], BU11[9], BU11[10], BU11[11], BU11[12], BU11[13], BU11[14], BU11[15]}),
    .R12({BU12[0], BU12[1], BU12[2], BU12[3], BU12[4], BU12[5], BU12[6], BU12[7], BU12[8], BU12[9], BU12[10], BU12[11], BU12[12], BU12[13], BU12[14], BU12[15]}),
    .R13({BU13[0], BU13[1], BU13[2], BU13[3], BU13[4], BU13[5], BU13[6], BU13[7], BU13[8], BU13[9], BU13[10], BU13[11], BU13[12], BU13[13], BU13[14], BU13[15]}),
    .R20({BU20[0], BU20[1], BU20[2], BU20[3], BU20[4], BU20[5], BU20[6], BU20[7], BU20[8], BU20[9], BU20[10], BU20[11], BU20[12], BU20[13], BU20[14], BU20[15]}),
    .R21({BU21[0], BU21[1], BU21[2], BU21[3], BU21[4], BU21[5], BU21[6], BU21[7], BU21[8], BU21[9], BU21[10], BU21[11], BU21[12], BU21[13], BU21[14], BU21[15]}),
    .R22({BU22[0], BU22[1], BU22[2], BU22[3], BU22[4], BU22[5], BU22[6], BU22[7], BU22[8], BU22[9], BU22[10], BU22[11], BU22[12], BU22[13], BU22[14], BU22[15]}),
    .R23({BU23[0], BU23[1], BU23[2], BU23[3], BU23[4], BU23[5], BU23[6], BU23[7], BU23[8], BU23[9], BU23[10], BU23[11], BU23[12], BU23[13], BU23[14], BU23[15]}),
    .R30({BU30[0], BU30[1], BU30[2], BU30[3], BU30[4], BU30[5], BU30[6], BU30[7], BU30[8], BU30[9], BU30[10], BU30[11], BU30[12], BU30[13], BU30[14], BU30[15]}),
    .R31({BU31[0], BU31[1], BU31[2], BU31[3], BU31[4], BU31[5], BU31[6], BU31[7], BU31[8], BU31[9], BU31[10], BU31[11], BU31[12], BU31[13], BU31[14], BU31[15]}),
    .R32({BU32[0], BU32[1], BU32[2], BU32[3], BU32[4], BU32[5], BU32[6], BU32[7], BU32[8], BU32[9], BU32[10], BU32[11], BU32[12], BU32[13], BU32[14], BU32[15]}),
    .R33({BU33[0], BU33[1], BU33[2], BU33[3], BU33[4], BU33[5], BU33[6], BU33[7], BU33[8], BU33[9], BU33[10], BU33[11], BU33[12], BU33[13], BU33[14], BU33[15]}));
  or inst200 (LAST, HL3, HR3, VL3, VR3);
  or inst140 (inst140_out, VL2, NRUN, VR2);
  Brain inst60 (
    .A(R10), .B(R20), .L(LL), .CLK(VA2), .CL(NRUN),
    .OA({MVR10[0], MVR10[1], MVR10[2], MVR10[3], MVR10[4], MVR10[5], MVR10[6], MVR10[7], MVR10[8], MVR10[9], MVR10[10], MVR10[11], MVR10[12], MVR10[13], MVR10[14], MVR10[15]}),
    .OB({MVR20[0], MVR20[1], MVR20[2], MVR20[3], MVR20[4], MVR20[5], MVR20[6], MVR20[7], MVR20[8], MVR20[9], MVR20[10], MVR20[11], MVR20[12], MVR20[13], MVR20[14], MVR20[15]}));
  Brain inst63 (
    .A(R11), .B(R21), .L(LL), .CLK(VA2), .CL(NRUN),
    .OA({MVR11[0], MVR11[1], MVR11[2], MVR11[3], MVR11[4], MVR11[5], MVR11[6], MVR11[7], MVR11[8], MVR11[9], MVR11[10], MVR11[11], MVR11[12], MVR11[13], MVR11[14], MVR11[15]}),
    .OB({MVR21[0], MVR21[1], MVR21[2], MVR21[3], MVR21[4], MVR21[5], MVR21[6], MVR21[7], MVR21[8], MVR21[9], MVR21[10], MVR21[11], MVR21[12], MVR21[13], MVR21[14], MVR21[15]}));
  Brain inst66 (
    .A(R12), .B(R22), .L(LL), .CLK(VA2), .CL(NRUN),
    .OA({MVR12[0], MVR12[1], MVR12[2], MVR12[3], MVR12[4], MVR12[5], MVR12[6], MVR12[7], MVR12[8], MVR12[9], MVR12[10], MVR12[11], MVR12[12], MVR12[13], MVR12[14], MVR12[15]}),
    .OB({MVR22[0], MVR22[1], MVR22[2], MVR22[3], MVR22[4], MVR22[5], MVR22[6], MVR22[7], MVR22[8], MVR22[9], MVR22[10], MVR22[11], MVR22[12], MVR22[13], MVR22[14], MVR22[15]}));
  Brain inst69 (
    .A(R13), .B(R23), .L(LL), .CLK(VA2), .CL(NRUN),
    .OA({MVR13[0], MVR13[1], MVR13[2], MVR13[3], MVR13[4], MVR13[5], MVR13[6], MVR13[7], MVR13[8], MVR13[9], MVR13[10], MVR13[11], MVR13[12], MVR13[13], MVR13[14], MVR13[15]}),
    .OB({MVR23[0], MVR23[1], MVR23[2], MVR23[3], MVR23[4], MVR23[5], MVR23[6], MVR23[7], MVR23[8], MVR23[9], MVR23[10], MVR23[11], MVR23[12], MVR23[13], MVR23[14], MVR23[15]}));
  or inst138 (CNT0, HL1, HL3, HR1, HR3, VL1, VL3, VR1, VR3);
  and inst149 (VA2, inst140_out, CLK);
  CHECKER inst240 (
    .R00(R00), .R01(R01), .R02(R02), .R03(R03), .R10(R10), .R11(R11), .R12(R12), .R13(R13), .R20(R20),
    .R21(R21), .R22(R22), .R23(R23), .R30(R30), .R31(R31), .R32(R32), .R33(R33),
    .PR00({CHK00[0], CHK00[1], CHK00[2], CHK00[3], CHK00[4], CHK00[5], CHK00[6], CHK00[7], CHK00[8], CHK00[9], CHK00[10], CHK00[11], CHK00[12], CHK00[13], CHK00[14], CHK00[15]}),
    .PR01({CHK01[0], CHK01[1], CHK01[2], CHK01[3], CHK01[4], CHK01[5], CHK01[6], CHK01[7], CHK01[8], CHK01[9], CHK01[10], CHK01[11], CHK01[12], CHK01[13], CHK01[14], CHK01[15]}),
    .PR02({CHK02[0], CHK02[1], CHK02[2], CHK02[3], CHK02[4], CHK02[5], CHK02[6], CHK02[7], CHK02[8], CHK02[9], CHK02[10], CHK02[11], CHK02[12], CHK02[13], CHK02[14], CHK02[15]}),
    .PR03({CHK03[0], CHK03[1], CHK03[2], CHK03[3], CHK03[4], CHK03[5], CHK03[6], CHK03[7], CHK03[8], CHK03[9], CHK03[10], CHK03[11], CHK03[12], CHK03[13], CHK03[14], CHK03[15]}),
    .PR10({CHK10[0], CHK10[1], CHK10[2], CHK10[3], CHK10[4], CHK10[5], CHK10[6], CHK10[7], CHK10[8], CHK10[9], CHK10[10], CHK10[11], CHK10[12], CHK10[13], CHK10[14], CHK10[15]}),
    .PR11({CHK11[0], CHK11[1], CHK11[2], CHK11[3], CHK11[4], CHK11[5], CHK11[6], CHK11[7], CHK11[8], CHK11[9], CHK11[10], CHK11[11], CHK11[12], CHK11[13], CHK11[14], CHK11[15]}),
    .PR12({CHK12[0], CHK12[1], CHK12[2], CHK12[3], CHK12[4], CHK12[5], CHK12[6], CHK12[7], CHK12[8], CHK12[9], CHK12[10], CHK12[11], CHK12[12], CHK12[13], CHK12[14], CHK12[15]}),
    .PR13({CHK13[0], CHK13[1], CHK13[2], CHK13[3], CHK13[4], CHK13[5], CHK13[6], CHK13[7], CHK13[8], CHK13[9], CHK13[10], CHK13[11], CHK13[12], CHK13[13], CHK13[14], CHK13[15]}),
    .PR20({CHK20[0], CHK20[1], CHK20[2], CHK20[3], CHK20[4], CHK20[5], CHK20[6], CHK20[7], CHK20[8], CHK20[9], CHK20[10], CHK20[11], CHK20[12], CHK20[13], CHK20[14], CHK20[15]}),
    .PR21({CHK21[0], CHK21[1], CHK21[2], CHK21[3], CHK21[4], CHK21[5], CHK21[6], CHK21[7], CHK21[8], CHK21[9], CHK21[10], CHK21[11], CHK21[12], CHK21[13], CHK21[14], CHK21[15]}),
    .PR22({CHK22[0], CHK22[1], CHK22[2], CHK22[3], CHK22[4], CHK22[5], CHK22[6], CHK22[7], CHK22[8], CHK22[9], CHK22[10], CHK22[11], CHK22[12], CHK22[13], CHK22[14], CHK22[15]}),
    .PR23({CHK23[0], CHK23[1], CHK23[2], CHK23[3], CHK23[4], CHK23[5], CHK23[6], CHK23[7], CHK23[8], CHK23[9], CHK23[10], CHK23[11], CHK23[12], CHK23[13], CHK23[14], CHK23[15]}),
    .PR30({CHK30[0], CHK30[1], CHK30[2], CHK30[3], CHK30[4], CHK30[5], CHK30[6], CHK30[7], CHK30[8], CHK30[9], CHK30[10], CHK30[11], CHK30[12], CHK30[13], CHK30[14], CHK30[15]}),
    .PR31({CHK31[0], CHK31[1], CHK31[2], CHK31[3], CHK31[4], CHK31[5], CHK31[6], CHK31[7], CHK31[8], CHK31[9], CHK31[10], CHK31[11], CHK31[12], CHK31[13], CHK31[14], CHK31[15]}),
    .PR32({CHK32[0], CHK32[1], CHK32[2], CHK32[3], CHK32[4], CHK32[5], CHK32[6], CHK32[7], CHK32[8], CHK32[9], CHK32[10], CHK32[11], CHK32[12], CHK32[13], CHK32[14], CHK32[15]}),
    .PR33({CHK33[0], CHK33[1], CHK33[2], CHK33[3], CHK33[4], CHK33[5], CHK33[6], CHK33[7], CHK33[8], CHK33[9], CHK33[10], CHK33[11], CHK33[12], CHK33[13], CHK33[14], CHK33[15]}),
    .DIFF(DIF));
  GameOver inst155 (
    .R00(R00), .R01(R01), .R02(R02), .R03(R03), .R10(R10), .R11(R11), .R12(R12), .R13(R13), .R20(R20),
    .R21(R21), .R22(R22), .R23(R23), .R30(R30), .R31(R31), .R32(R32), .R33(R33), .is(CL));
  or inst141 (inst141_out, VL3, NRUN, VR1);
  Brain inst61 (
    .A(R20), .B(R30), .L(LL), .CLK(VA3), .CL(NRUN),
    .OA({VR20[0], VR20[1], VR20[2], VR20[3], VR20[4], VR20[5], VR20[6], VR20[7], VR20[8], VR20[9], VR20[10], VR20[11], VR20[12], VR20[13], VR20[14], VR20[15]}),
    .OB({VR30[0], VR30[1], VR30[2], VR30[3], VR30[4], VR30[5], VR30[6], VR30[7], VR30[8], VR30[9], VR30[10], VR30[11], VR30[12], VR30[13], VR30[14], VR30[15]}));
  Brain inst64 (
    .A(R21), .B(R31), .L(LL), .CLK(VA3), .CL(NRUN),
    .OA({VR21[0], VR21[1], VR21[2], VR21[3], VR21[4], VR21[5], VR21[6], VR21[7], VR21[8], VR21[9], VR21[10], VR21[11], VR21[12], VR21[13], VR21[14], VR21[15]}),
    .OB({VR31[0], VR31[1], VR31[2], VR31[3], VR31[4], VR31[5], VR31[6], VR31[7], VR31[8], VR31[9], VR31[10], VR31[11], VR31[12], VR31[13], VR31[14], VR31[15]}));
  Brain inst67 (
    .A(R22), .B(R32), .L(LL), .CLK(VA3), .CL(NRUN),
    .OA({VR22[0], VR22[1], VR22[2], VR22[3], VR22[4], VR22[5], VR22[6], VR22[7], VR22[8], VR22[9], VR22[10], VR22[11], VR22[12], VR22[13], VR22[14], VR22[15]}),
    .OB({VR32[0], VR32[1], VR32[2], VR32[3], VR32[4], VR32[5], VR32[6], VR32[7], VR32[8], VR32[9], VR32[10], VR32[11], VR32[12], VR32[13], VR32[14], VR32[15]}));
  Brain inst70 (
    .A(R23), .B(R33), .L(LL), .CLK(VA3), .CL(NRUN),
    .OA({VR23[0], VR23[1], VR23[2], VR23[3], VR23[4], VR23[5], VR23[6], VR23[7], VR23[8], VR23[9], VR23[10], VR23[11], VR23[12], VR23[13], VR23[14], VR23[15]}),
    .OB({VR33[0], VR33[1], VR33[2], VR33[3], VR33[4], VR33[5], VR33[6], VR33[7], VR33[8], VR33[9], VR33[10], VR33[11], VR33[12], VR33[13], VR33[14], VR33[15]}));
  and inst150 (VA3, inst141_out, CLK);
  \MP4-1  inst78 (
    .I0({MVR10[0], MVR10[1], MVR10[2], MVR10[3], MVR10[4], MVR10[5], MVR10[6], MVR10[7], MVR10[8], MVR10[9], MVR10[10], MVR10[11], MVR10[12], MVR10[13], MVR10[14], MVR10[15]}),
    .I1({VR10[0], VR10[1], VR10[2], VR10[3], VR10[4], VR10[5], VR10[6], VR10[7], VR10[8], VR10[9], VR10[10], VR10[11], VR10[12], VR10[13], VR10[14], VR10[15]}),
    .I2({HR10[0], HR10[1], HR10[2], HR10[3], HR10[4], HR10[5], HR10[6], HR10[7], HR10[8], HR10[9], HR10[10], HR10[11], HR10[12], HR10[13], HR10[14], HR10[15]}),
    .I3({HR10[0], HR10[1], HR10[2], HR10[3], HR10[4], HR10[5], HR10[6], HR10[7], HR10[8], HR10[9], HR10[10], HR10[11], HR10[12], HR10[13], HR10[14], HR10[15]}),
    .S0(CNT0), .S1(hor), .y(inst78_y));
  \MP4-1  inst79 (
    .I0({MVR20[0], MVR20[1], MVR20[2], MVR20[3], MVR20[4], MVR20[5], MVR20[6], MVR20[7], MVR20[8], MVR20[9], MVR20[10], MVR20[11], MVR20[12], MVR20[13], MVR20[14], MVR20[15]}),
    .I1({VR20[0], VR20[1], VR20[2], VR20[3], VR20[4], VR20[5], VR20[6], VR20[7], VR20[8], VR20[9], VR20[10], VR20[11], VR20[12], VR20[13], VR20[14], VR20[15]}),
    .I2({HR20[0], HR20[1], HR20[2], HR20[3], HR20[4], HR20[5], HR20[6], HR20[7], HR20[8], HR20[9], HR20[10], HR20[11], HR20[12], HR20[13], HR20[14], HR20[15]}),
    .I3({HR20[0], HR20[1], HR20[2], HR20[3], HR20[4], HR20[5], HR20[6], HR20[7], HR20[8], HR20[9], HR20[10], HR20[11], HR20[12], HR20[13], HR20[14], HR20[15]}),
    .S0(CNT0), .S1(hor), .y(inst79_y));
  MP2X #(.size(16)) inst72 (
    .S(hor),
    .X0({VR00[0], VR00[1], VR00[2], VR00[3], VR00[4], VR00[5], VR00[6], VR00[7], VR00[8], VR00[9], VR00[10], VR00[11], VR00[12], VR00[13], VR00[14], VR00[15]}),
    .X1({HR00[0], HR00[1], HR00[2], HR00[3], HR00[4], HR00[5], HR00[6], HR00[7], HR00[8], HR00[9], HR00[10], HR00[11], HR00[12], HR00[13], HR00[14], HR00[15]}),
    .Y(inst72_y));
  MP2X #(.size(16)) inst80 (
    .S(hor),
    .X0({VR30[0], VR30[1], VR30[2], VR30[3], VR30[4], VR30[5], VR30[6], VR30[7], VR30[8], VR30[9], VR30[10], VR30[11], VR30[12], VR30[13], VR30[14], VR30[15]}),
    .X1({HR30[0], HR30[1], HR30[2], HR30[3], HR30[4], HR30[5], HR30[6], HR30[7], HR30[8], HR30[9], HR30[10], HR30[11], HR30[12], HR30[13], HR30[14], HR30[15]}),
    .Y(inst80_y));
  and inst230 (inst230_out, LRND30, GENED);
  MP2X #(.size(16)) inst73 (
    .S(inst157_out), .X0(inst72_y),
    .X1({dva[0], dva[1], dva[2], dva[3], dva[4], dva[5], dva[6], dva[7], dva[8], dva[9], dva[10], dva[11], dva[12], dva[13], dva[14], dva[15]}),
    .Y(inst73_y));
  and inst157 (inst157_out, LRND00, GENED);
  MP2X #(.size(16)) inst96 (
    .S(inst229_out), .X0(inst78_y),
    .X1({dva[0], dva[1], dva[2], dva[3], dva[4], dva[5], dva[6], dva[7], dva[8], dva[9], dva[10], dva[11], dva[12], dva[13], dva[14], dva[15]}),
    .Y(inst96_y));
  and inst229 (inst229_out, LRND10, GENED);
  MP2X #(.size(16)) inst97 (
    .S(inst237_out), .X0(inst79_y),
    .X1({dva[0], dva[1], dva[2], dva[3], dva[4], dva[5], dva[6], dva[7], dva[8], dva[9], dva[10], dva[11], dva[12], dva[13], dva[14], dva[15]}),
    .Y(inst97_y));
  and inst237 (inst237_out, LRND20, GENED);
  MP2X #(.size(16)) inst81 (
    .S(inst230_out), .X0(inst80_y),
    .X1({dva[0], dva[1], dva[2], dva[3], dva[4], dva[5], dva[6], dva[7], dva[8], dva[9], dva[10], dva[11], dva[12], dva[13], dva[14], dva[15]}),
    .Y(inst81_y));
  MP2X #(.size(16)) inst242 (
    .S(RELOAD), .X0(inst73_y),
    .X1({BU00[0], BU00[1], BU00[2], BU00[3], BU00[4], BU00[5], BU00[6], BU00[7], BU00[8], BU00[9], BU00[10], BU00[11], BU00[12], BU00[13], BU00[14], BU00[15]}),
    .Y({C00[0], C00[1], C00[2], C00[3], C00[4], C00[5], C00[6], C00[7], C00[8], C00[9], C00[10], C00[11], C00[12], C00[13], C00[14], C00[15]}));
  MP2X #(.size(16)) inst245 (
    .S(RELOAD), .X0(inst81_y),
    .X1({BU30[0], BU30[1], BU30[2], BU30[3], BU30[4], BU30[5], BU30[6], BU30[7], BU30[8], BU30[9], BU30[10], BU30[11], BU30[12], BU30[13], BU30[14], BU30[15]}),
    .Y({C30[0], C30[1], C30[2], C30[3], C30[4], C30[5], C30[6], C30[7], C30[8], C30[9], C30[10], C30[11], C30[12], C30[13], C30[14], C30[15]}));
  MP2X #(.size(16)) inst243 (
    .S(RELOAD), .X0(inst96_y),
    .X1({BU10[0], BU10[1], BU10[2], BU10[3], BU10[4], BU10[5], BU10[6], BU10[7], BU10[8], BU10[9], BU10[10], BU10[11], BU10[12], BU10[13], BU10[14], BU10[15]}),
    .Y({C10[0], C10[1], C10[2], C10[3], C10[4], C10[5], C10[6], C10[7], C10[8], C10[9], C10[10], C10[11], C10[12], C10[13], C10[14], C10[15]}));
  MP2X #(.size(16)) inst244 (
    .S(RELOAD), .X0(inst97_y),
    .X1({BU20[0], BU20[1], BU20[2], BU20[3], BU20[4], BU20[5], BU20[6], BU20[7], BU20[8], BU20[9], BU20[10], BU20[11], BU20[12], BU20[13], BU20[14], BU20[15]}),
    .Y({C20[0], C20[1], C20[2], C20[3], C20[4], C20[5], C20[6], C20[7], C20[8], C20[9], C20[10], C20[11], C20[12], C20[13], C20[14], C20[15]}));
  \MP4-1  inst98 (
    .I0({VR01[0], VR01[1], VR01[2], VR01[3], VR01[4], VR01[5], VR01[6], VR01[7], VR01[8], VR01[9], VR01[10], VR01[11], VR01[12], VR01[13], VR01[14], VR01[15]}),
    .I1({VR01[0], VR01[1], VR01[2], VR01[3], VR01[4], VR01[5], VR01[6], VR01[7], VR01[8], VR01[9], VR01[10], VR01[11], VR01[12], VR01[13], VR01[14], VR01[15]}),
    .I2({MHR01[0], MHR01[1], MHR01[2], MHR01[3], MHR01[4], MHR01[5], MHR01[6], MHR01[7], MHR01[8], MHR01[9], MHR01[10], MHR01[11], MHR01[12], MHR01[13], MHR01[14], MHR01[15]}),
    .I3({HR01[0], HR01[1], HR01[2], HR01[3], HR01[4], HR01[5], HR01[6], HR01[7], HR01[8], HR01[9], HR01[10], HR01[11], HR01[12], HR01[13], HR01[14], HR01[15]}),
    .S0(CNT0), .S1(hor), .y(inst98_y));
  \MP4-1  inst89 (
    .I0({MVR11[0], MVR11[1], MVR11[2], MVR11[3], MVR11[4], MVR11[5], MVR11[6], MVR11[7], MVR11[8], MVR11[9], MVR11[10], MVR11[11], MVR11[12], MVR11[13], MVR11[14], MVR11[15]}),
    .I1({VR11[0], VR11[1], VR11[2], VR11[3], VR11[4], VR11[5], VR11[6], VR11[7], VR11[8], VR11[9], VR11[10], VR11[11], VR11[12], VR11[13], VR11[14], VR11[15]}),
    .I2({MHR11[0], MHR11[1], MHR11[2], MHR11[3], MHR11[4], MHR11[5], MHR11[6], MHR11[7], MHR11[8], MHR11[9], MHR11[10], MHR11[11], MHR11[12], MHR11[13], MHR11[14], MHR11[15]}),
    .I3({HR11[0], HR11[1], HR11[2], HR11[3], HR11[4], HR11[5], HR11[6], HR11[7], HR11[8], HR11[9], HR11[10], HR11[11], HR11[12], HR11[13], HR11[14], HR11[15]}),
    .S0(CNT0), .S1(hor), .y(inst89_y));
  \MP4-1  inst93 (
    .I0({MVR21[0], MVR21[1], MVR21[2], MVR21[3], MVR21[4], MVR21[5], MVR21[6], MVR21[7], MVR21[8], MVR21[9], MVR21[10], MVR21[11], MVR21[12], MVR21[13], MVR21[14], MVR21[15]}),
    .I1({VR21[0], VR21[1], VR21[2], VR21[3], VR21[4], VR21[5], VR21[6], VR21[7], VR21[8], VR21[9], VR21[10], VR21[11], VR21[12], VR21[13], VR21[14], VR21[15]}),
    .I2({MHR21[0], MHR21[1], MHR21[2], MHR21[3], MHR21[4], MHR21[5], MHR21[6], MHR21[7], MHR21[8], MHR21[9], MHR21[10], MHR21[11], MHR21[12], MHR21[13], MHR21[14], MHR21[15]}),
    .I3({HR21[0], HR21[1], HR21[2], HR21[3], HR21[4], HR21[5], HR21[6], HR21[7], HR21[8], HR21[9], HR21[10], HR21[11], HR21[12], HR21[13], HR21[14], HR21[15]}),
    .S0(CNT0), .S1(hor), .y(inst93_y));
  \MP4-1  inst84 (
    .I0({VR31[0], VR31[1], VR31[2], VR31[3], VR31[4], VR31[5], VR31[6], VR31[7], VR31[8], VR31[9], VR31[10], VR31[11], VR31[12], VR31[13], VR31[14], VR31[15]}),
    .I1({VR31[0], VR31[1], VR31[2], VR31[3], VR31[4], VR31[5], VR31[6], VR31[7], VR31[8], VR31[9], VR31[10], VR31[11], VR31[12], VR31[13], VR31[14], VR31[15]}),
    .I2({MHR31[0], MHR31[1], MHR31[2], MHR31[3], MHR31[4], MHR31[5], MHR31[6], MHR31[7], MHR31[8], MHR31[9], MHR31[10], MHR31[11], MHR31[12], MHR31[13], MHR31[14], MHR31[15]}),
    .I3({HR31[0], HR31[1], HR31[2], HR31[3], HR31[4], HR31[5], HR31[6], HR31[7], HR31[8], HR31[9], HR31[10], HR31[11], HR31[12], HR31[13], HR31[14], HR31[15]}),
    .S0(CNT0), .S1(hor), .y(inst84_y));
  and inst236 (inst236_out, LRND21, GENED);
  and inst219 (inst219_out, LRND01, GENED);
  and inst228 (inst228_out, LRND11, GENED);
  MP2X #(.size(16)) inst99 (
    .S(inst219_out), .X0(inst98_y),
    .X1({dva[0], dva[1], dva[2], dva[3], dva[4], dva[5], dva[6], dva[7], dva[8], dva[9], dva[10], dva[11], dva[12], dva[13], dva[14], dva[15]}),
    .Y(inst99_y));
  MP2X #(.size(16)) inst88 (
    .S(inst228_out), .X0(inst89_y),
    .X1({dva[0], dva[1], dva[2], dva[3], dva[4], dva[5], dva[6], dva[7], dva[8], dva[9], dva[10], dva[11], dva[12], dva[13], dva[14], dva[15]}),
    .Y(inst88_y));
  MP2X #(.size(16)) inst92 (
    .S(inst268_out), .X0(inst93_y),
    .X1({dva[0], dva[1], dva[2], dva[3], dva[4], dva[5], dva[6], dva[7], dva[8], dva[9], dva[10], dva[11], dva[12], dva[13], dva[14], dva[15]}),
    .Y(inst92_y));
  or inst268 (inst268_out, inst236_out, CL);
  MP2X #(.size(16)) inst102 (
    .S(inst231_out), .X0(inst84_y),
    .X1({dva[0], dva[1], dva[2], dva[3], dva[4], dva[5], dva[6], dva[7], dva[8], dva[9], dva[10], dva[11], dva[12], dva[13], dva[14], dva[15]}),
    .Y(inst102_y));
  and inst231 (inst231_out, LRND31, GENED);
  MP2X #(.size(16)) inst249 (
    .S(RELOAD), .X0(inst99_y),
    .X1({BU01[0], BU01[1], BU01[2], BU01[3], BU01[4], BU01[5], BU01[6], BU01[7], BU01[8], BU01[9], BU01[10], BU01[11], BU01[12], BU01[13], BU01[14], BU01[15]}),
    .Y({C01[0], C01[1], C01[2], C01[3], C01[4], C01[5], C01[6], C01[7], C01[8], C01[9], C01[10], C01[11], C01[12], C01[13], C01[14], C01[15]}));
  MP2X #(.size(16)) inst248 (
    .S(RELOAD), .X0(inst88_y),
    .X1({BU11[0], BU11[1], BU11[2], BU11[3], BU11[4], BU11[5], BU11[6], BU11[7], BU11[8], BU11[9], BU11[10], BU11[11], BU11[12], BU11[13], BU11[14], BU11[15]}),
    .Y({C11[0], C11[1], C11[2], C11[3], C11[4], C11[5], C11[6], C11[7], C11[8], C11[9], C11[10], C11[11], C11[12], C11[13], C11[14], C11[15]}));
  MP2X #(.size(16)) inst247 (
    .S(RELOAD), .X0(inst92_y),
    .X1({BU21[0], BU21[1], BU21[2], BU21[3], BU21[4], BU21[5], BU21[6], BU21[7], BU21[8], BU21[9], BU21[10], BU21[11], BU21[12], BU21[13], BU21[14], BU21[15]}),
    .Y({C21[0], C21[1], C21[2], C21[3], C21[4], C21[5], C21[6], C21[7], C21[8], C21[9], C21[10], C21[11], C21[12], C21[13], C21[14], C21[15]}));
  MP2X #(.size(16)) inst246 (
    .S(RELOAD), .X0(inst102_y),
    .X1({BU31[0], BU31[1], BU31[2], BU31[3], BU31[4], BU31[5], BU31[6], BU31[7], BU31[8], BU31[9], BU31[10], BU31[11], BU31[12], BU31[13], BU31[14], BU31[15]}),
    .Y({C31[0], C31[1], C31[2], C31[3], C31[4], C31[5], C31[6], C31[7], C31[8], C31[9], C31[10], C31[11], C31[12], C31[13], C31[14], C31[15]}));
  \MP4-1  inst91 (
    .I0({MVR12[0], MVR12[1], MVR12[2], MVR12[3], MVR12[4], MVR12[5], MVR12[6], MVR12[7], MVR12[8], MVR12[9], MVR12[10], MVR12[11], MVR12[12], MVR12[13], MVR12[14], MVR12[15]}),
    .I1({VR12[0], VR12[1], VR12[2], VR12[3], VR12[4], VR12[5], VR12[6], VR12[7], VR12[8], VR12[9], VR12[10], VR12[11], VR12[12], VR12[13], VR12[14], VR12[15]}),
    .I2({MHR12[0], MHR12[1], MHR12[2], MHR12[3], MHR12[4], MHR12[5], MHR12[6], MHR12[7], MHR12[8], MHR12[9], MHR12[10], MHR12[11], MHR12[12], MHR12[13], MHR12[14], MHR12[15]}),
    .I3({HR12[0], HR12[1], HR12[2], HR12[3], HR12[4], HR12[5], HR12[6], HR12[7], HR12[8], HR12[9], HR12[10], HR12[11], HR12[12], HR12[13], HR12[14], HR12[15]}),
    .S0(CNT0), .S1(hor), .y(inst91_y));
  \MP4-1  inst100 (
    .I0({VR02[0], VR02[1], VR02[2], VR02[3], VR02[4], VR02[5], VR02[6], VR02[7], VR02[8], VR02[9], VR02[10], VR02[11], VR02[12], VR02[13], VR02[14], VR02[15]}),
    .I1({VR02[0], VR02[1], VR02[2], VR02[3], VR02[4], VR02[5], VR02[6], VR02[7], VR02[8], VR02[9], VR02[10], VR02[11], VR02[12], VR02[13], VR02[14], VR02[15]}),
    .I2({MHR02[0], MHR02[1], MHR02[2], MHR02[3], MHR02[4], MHR02[5], MHR02[6], MHR02[7], MHR02[8], MHR02[9], MHR02[10], MHR02[11], MHR02[12], MHR02[13], MHR02[14], MHR02[15]}),
    .I3({HR02[0], HR02[1], HR02[2], HR02[3], HR02[4], HR02[5], HR02[6], HR02[7], HR02[8], HR02[9], HR02[10], HR02[11], HR02[12], HR02[13], HR02[14], HR02[15]}),
    .S0(CNT0), .S1(hor), .y(inst100_y));
  and inst225 (inst225_out, LRND12, GENED);
